# Altium project BeagleBone-AI.PrjPcb (part 3 of 5)

## Sheet 13 Processor Power Deco.SchDoc
size 420 x 297 mm
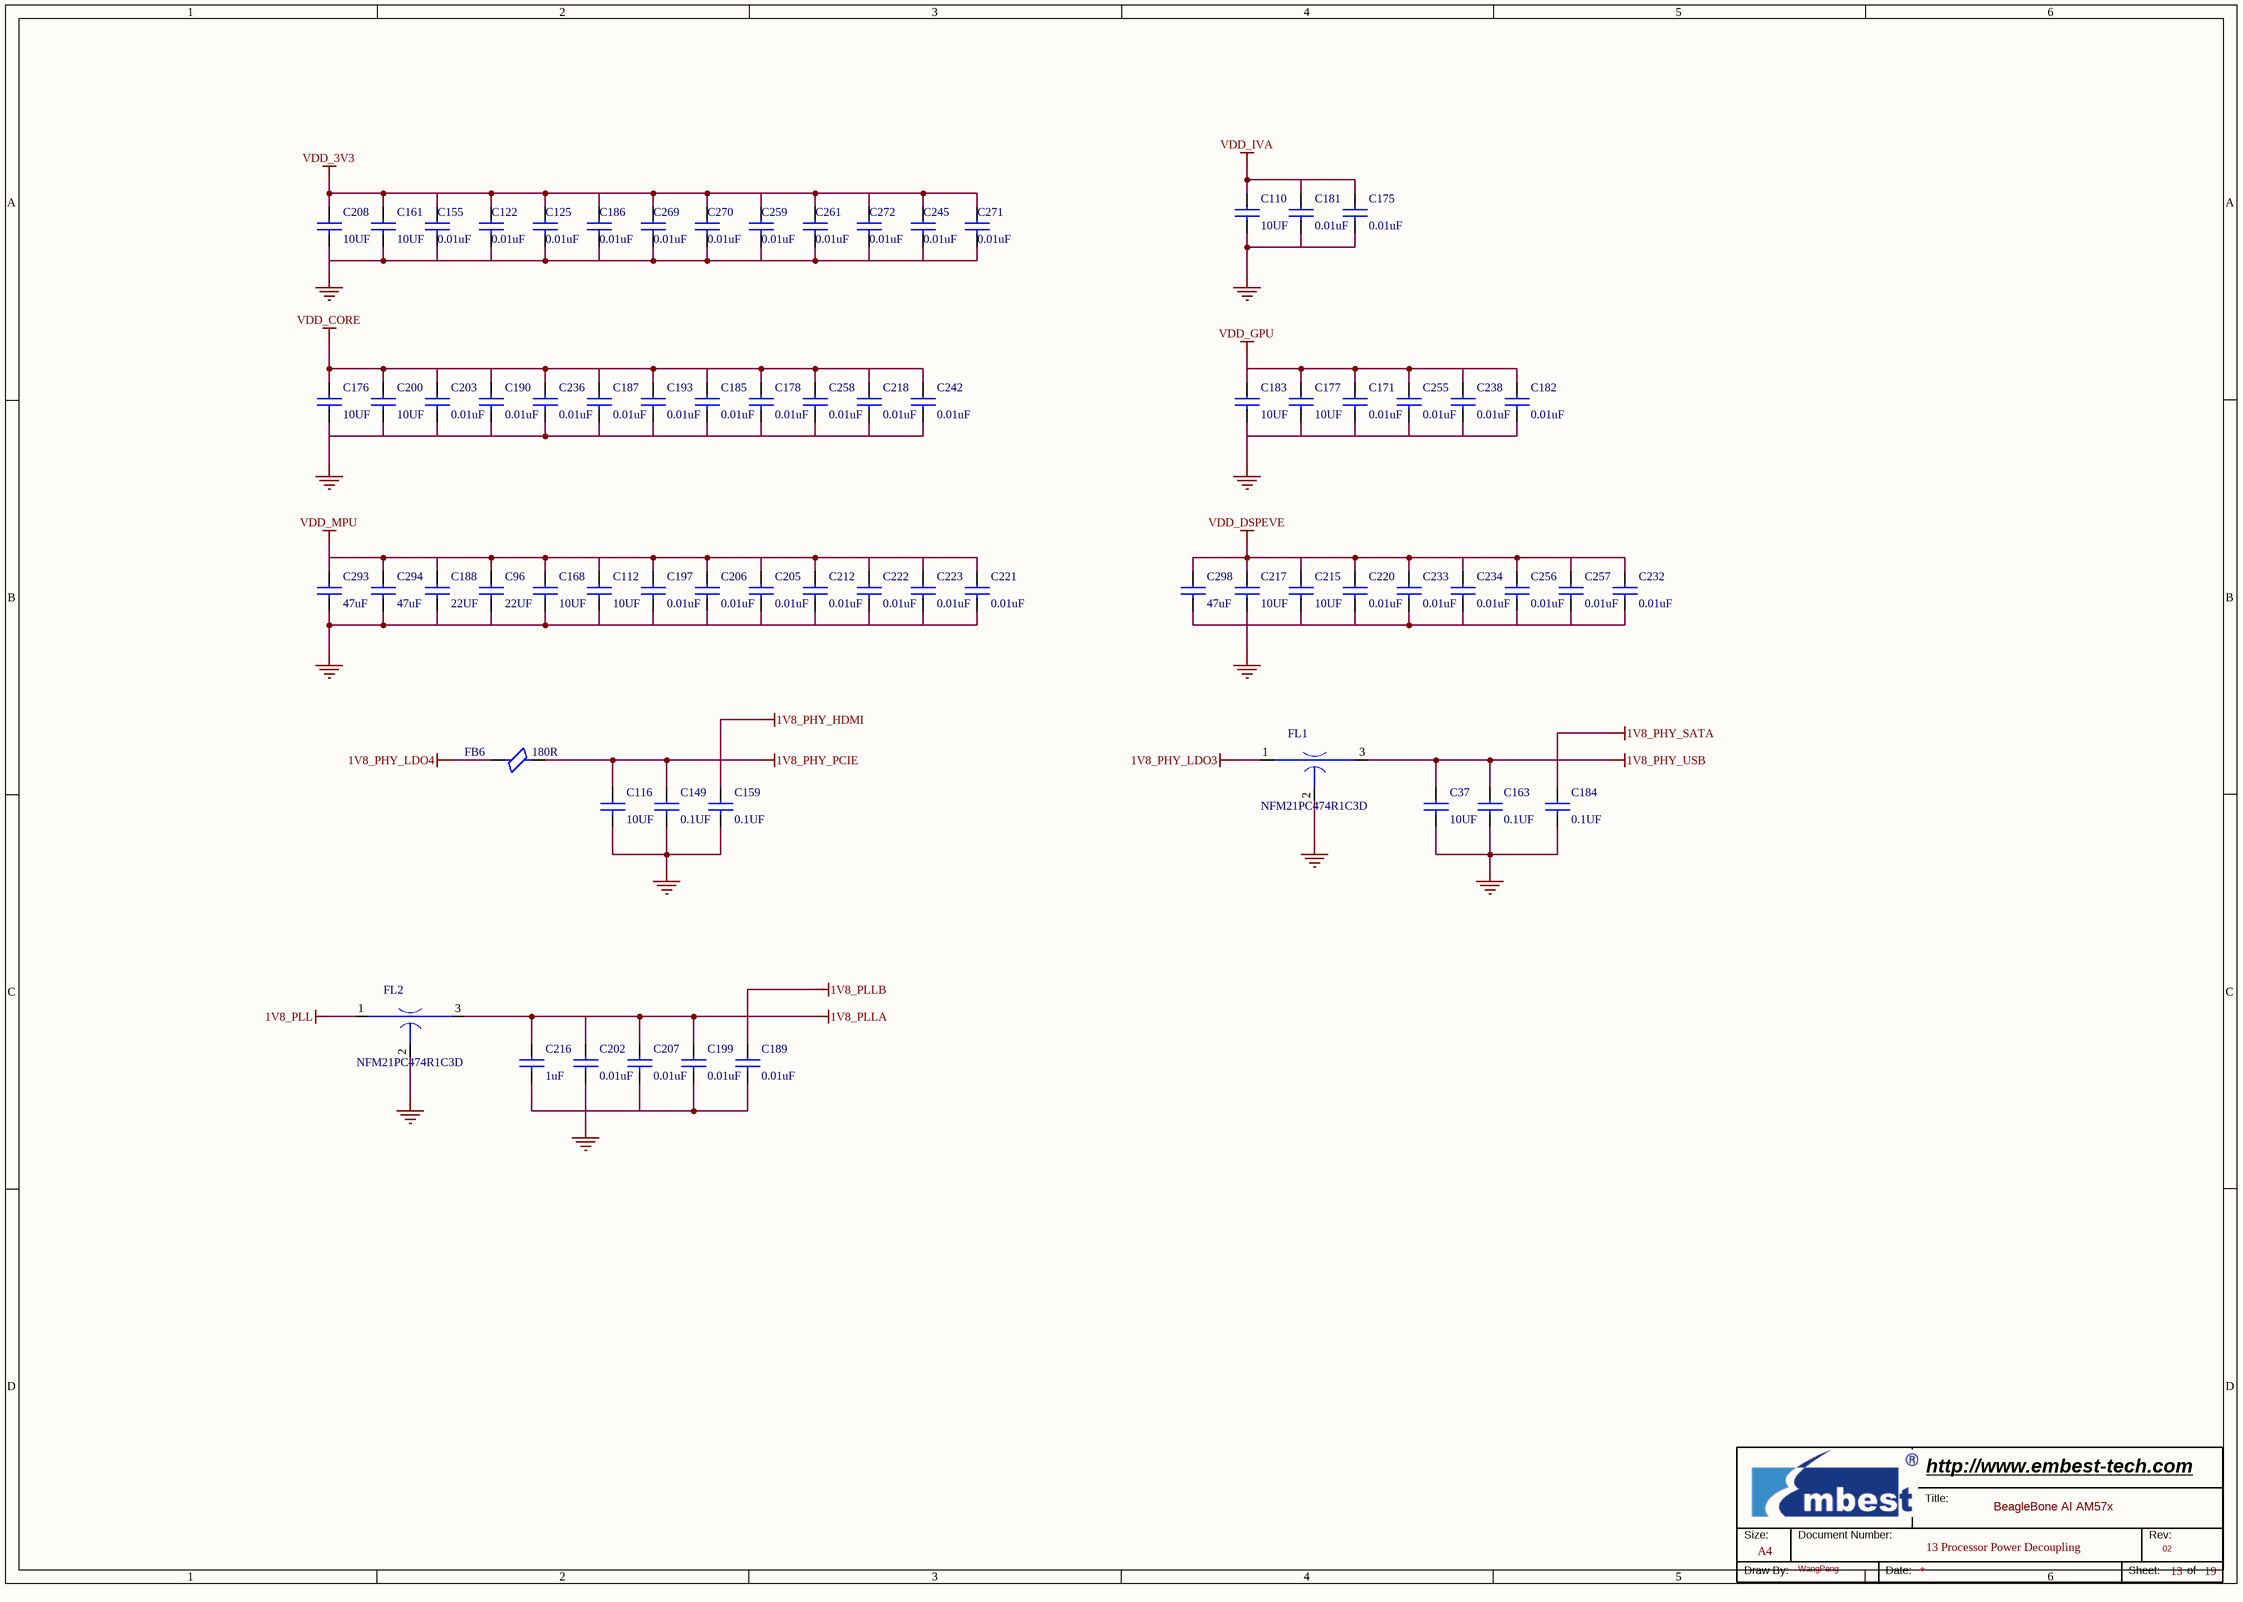
[diagram p14: 13 Processor Power Deco.SchDoc]

### Parts
(Parts that share a designator on the sheet are numbered #1, #2 ... from top to bottom, then left to right.)
*#11  Page Count: 19  Page Number: 13  Page Size: A4  Title: BeagleBone AI AM57x  RevCode: 02  Doc: 13 Processor Power Decoupling  Drawing: WangPeng  (hidden comment: Embest Title)  (graphical)
C37  10UF  [C0603]
C96  22UF  [C0603]
C110  10UF  [C0402]
C112  10UF  [C0402]
C116  10UF  [C0603]
C122  0.01uF  [C0402]
C125  0.01uF  [C0402]
C149  0.1UF  [C0402]
C155  0.01uF  [C0402]
C159  0.1UF  [C0402]
C161  10UF  [C0603]
C163  0.1UF  [C0402]
C168  10UF  [C0402]
C171  0.01uF  [C0402]
C175  0.01uF  [C0402]
C176  10UF  [C0402]
C177  10UF  [C0402]
C178  0.01uF  [C0402]
C181  0.01uF  [C0402]
C182  0.01uF  [C0402]
C183  10UF  [C0402]
C184  0.1UF  [C0402]
C185  0.01uF  [C0402]
C186  0.01uF  [C0402]
C187  0.01uF  [C0402]
C188  22UF  [C0603]
C189  0.01uF  [C0402]
C190  0.01uF  [C0402]
C193  0.01uF  [C0402]
C197  0.01uF  [C0402]
C199  0.01uF  [C0402]
C200  10UF  [C0402]
C202  0.01uF  [C0402]
C203  0.01uF  [C0402]
C205  0.01uF  [C0402]
C206  0.01uF  [C0402]
C207  0.01uF  [C0402]
C208  10UF  [C0603]
C212  0.01uF  [C0402]
C215  10UF  [C0402]
C216  1uF  [C0402]
C217  10UF  [C0402]
C218  0.01uF  [C0402]
C220  0.01uF  [C0402]
C221  0.01uF  [C0402]
C222  0.01uF  [C0402]
C223  0.01uF  [C0402]
C232  0.01uF  [C0402]
C233  0.01uF  [C0402]
C234  0.01uF  [C0402]
C236  0.01uF  [C0402]
C238  0.01uF  [C0402]
C242  0.01uF  [C0402]
C245  0.01uF  [C0402]
C255  0.01uF  [C0402]
C256  0.01uF  [C0402]
C257  0.01uF  [C0402]
C258  0.01uF  [C0402]
C259  0.01uF  [C0402]
C261  0.01uF  [C0402]
C269  0.01uF  [C0402]
C270  0.01uF  [C0402]
C271  0.01uF  [C0402]
C272  0.01uF  [C0402]
C293  47uF  [C0805]
C294  47uF  [C0805]
C298  47uF  [C0805]
FB6  180R  [L0603]
FL1  NFM21PC474R1C3D  [fl0805]
FL2  NFM21PC474R1C3D  [fl0805]

### Nets
1V8_PHY_HDMI: C159.1
1V8_PHY_LDO3: FL1.1
1V8_PHY_LDO4: FB6.1
1V8_PHY_PCIE: C116.1 C149.1 FB6.2
1V8_PHY_SATA: C184.1
1V8_PHY_USB: C37.1 C163.1 FL1.3
1V8_PLL: FL2.1
1V8_PLLA: C199.1 C202.1 C207.1 C216.1 FL2.3
1V8_PLLB: C189.1
GND: C37.2 C96.2 C110.2 C112.2 C116.2 C122.2 C125.2 C149.2 C155.2 C159.2 C161.2 C163.2 C168.2 C171.2 C175.2 C176.2 C177.2 C178.2 C181.2 C182.2 C183.2 C184.2 C185.2 C186.2 C187.2 C188.2 C190.2 C193.2 C197.2 C200.2 C202.2 C203.2 C205.2 C206.2 C208.2 C212.2 C217.2 C218.2 C221.2 C222.2 C223.2 C236.2 C238.2 C242.2 C245.2 C255.2 C258.2 C259.2 C261.2 C269.2 C270.2 C271.2 C272.2 C293.2 C294.2 FL1.2 FL2.2  [project net DDR1_RST]
VDD_3V3: C122.1 C125.1 C155.1 C161.1 C186.1 C208.1 C245.1 C259.1 C261.1 C269.1 C270.1 C271.1 C272.1
VDD_CORE: C176.1 C178.1 C185.1 C187.1 C190.1 C193.1 C200.1 C203.1 C218.1 C236.1 C242.1 C258.1
VDD_DSPEVE: C215.1 C217.1 C220.1 C232.1 C233.1 C234.1 C256.1 C257.1 C298.1
VDD_GPU: C171.1 C177.1 C182.1 C183.1 C238.1 C255.1
VDD_IVA: C110.1 C175.1 C181.1
VDD_MPU: C96.1 C112.1 C168.1 C188.1 C197.1 C205.1 C206.1 C212.1 C221.1 C222.1 C223.1 C293.1 C294.1
NetC189_2: C189.2 C199.2 C207.2 C216.2
NetC215_2: C215.2 C220.2 C232.2 C233.2 C234.2 C256.2 C257.2 C298.2

### Notes on the sheet
- (in symbol Embest Title) Title:; Size:; Document Number:; Rev:; Draw By:; Date:; Sheet:; of

### Library data of the parts
C37 C116 C161 = C: as C180 on sheet 12 Processor  Power; Datasheet: Y:\ÐÂK3ÏµÍ³ÎïÁÏdatasheet\[1003_1004]capacitor-resistor µçÈÝ¡¢µç×è\1004001100129T2 C1608X5R1A106M.pdf; Part Type: Ceramic Capacitor
C96 C188 = C: CAP,22UF,+/-20%,X5R,6.3V,SMD0603; Manufacturer: MURATA; Manufacturer Part Number: GRM188R60J226MEA0D; Embest PN: 1004001100130; Part Type: Ceramic Capacitor
C110 C112 C177 C200 = C: CAP,10UF,+/-20%,X5R,6.3V,SMD0402; Manufacturer: Yageo; Manufacturer Part Number: CC0402MRX5R5BB106; Embest PN: 1004001100345; Part Type: Ceramic Capacitor
C122 C125 C175 C181 C185-C187 C190 C193 C199 C203 C205-C207 C212 C220 C221 C223 C232-C234 C236 C242 C245 C256 C257 C259 C261 C272 = C: as C118 on sheet 12 Processor  Power; Part Type: Ceramic Capacitor
C149 C159 C163 = C: as C285 on sheet 09 MMC_UBOOT; Part Type: Ceramic Capacitor; Datasheet: Y:\ÐÂK3ÏµÍ³ÎïÁÏdatasheet\[1003_1004]capacitor-resistor µçÈÝ¡¢µç×è\1004001100047-GRM155R71C104KA88D.pdf
C155 C171 C178 C182 C189 C197 C202 C218 C222 C238 C255 C258 C269-C271 = C: as C119 on sheet 12 Processor  Power; Part Type: Ceramic Capacitor
C168 C176 C183 C215 C217 = C: CAP,10UF,+/-20%,X5R,6.3V,SMD0402; Manufacturer Part Number: CC0402MRX5R5BB106; Manufacturer: Yageo; Embest PN: 1004001100345; Part Type: Ceramic Capacitor
C184 = C: as C281 on sheet 09 MMC_UBOOT; Datasheet: Y:\ÐÂK3ÏµÍ³ÎïÁÏdatasheet\[1003_1004]capacitor-resistor µçÈÝ¡¢µç×è\1004001100047-GRM155R71C104KA88D.pdf; Part Type: Ceramic Capacitor
C208 = C: as C120 on sheet 12 Processor  Power; Part Type: Ceramic Capacitor; Datasheet: Y:\ÐÂK3ÏµÍ³ÎïÁÏdatasheet\[1003_1004]capacitor-resistor µçÈÝ¡¢µç×è\1004001100129T2 C1608X5R1A106M.pdf
C216 = C: CAP,1UF,+/-10%,X5R,16V,SMD0402; Manufacturer: Murata; Manufacturer Part Number: GRM155R61C105KA12D; Embest PN: 1004001100058; Part Type: Ceramic Capacitor
C293 C294 C298 = C: CAP,47UF,+/-20%,X5R,6.3V,SMD0805; Manufacturer Part Number: GRM21BR60J476ME15L; Manufacturer: MURATA; Embest PN: 1004001100164; Part Type: Ceramic Capacitor
FB6 = FB: Ferrite Bead,180ohm@100MHz,+/-25%,1500mA,0.09ohm,SMD0603; Manufacturer Part Number: BLM18PG181SN1D; Manufacturer: Murata; Embest PN: 1005005100012; Part Type: Ferrite Bead
FL1 FL2 = FL: CAP Feedthru 0.47UF 20% 16V 0805; Manufacturer: Murata; Embest PN: 1013002100020; Status: AM5728; Manufacturer Part Number: NFM21PC474R1C3D; Part Type: filter
*#11 = Embest Title: Page Create Date: May 29, 2006; WebSite: http://www.embest-tech.com; Company: Embest; Page Modify Date: *

## Sheet 14 Exp Conn.SchDoc
size 420 x 297 mm
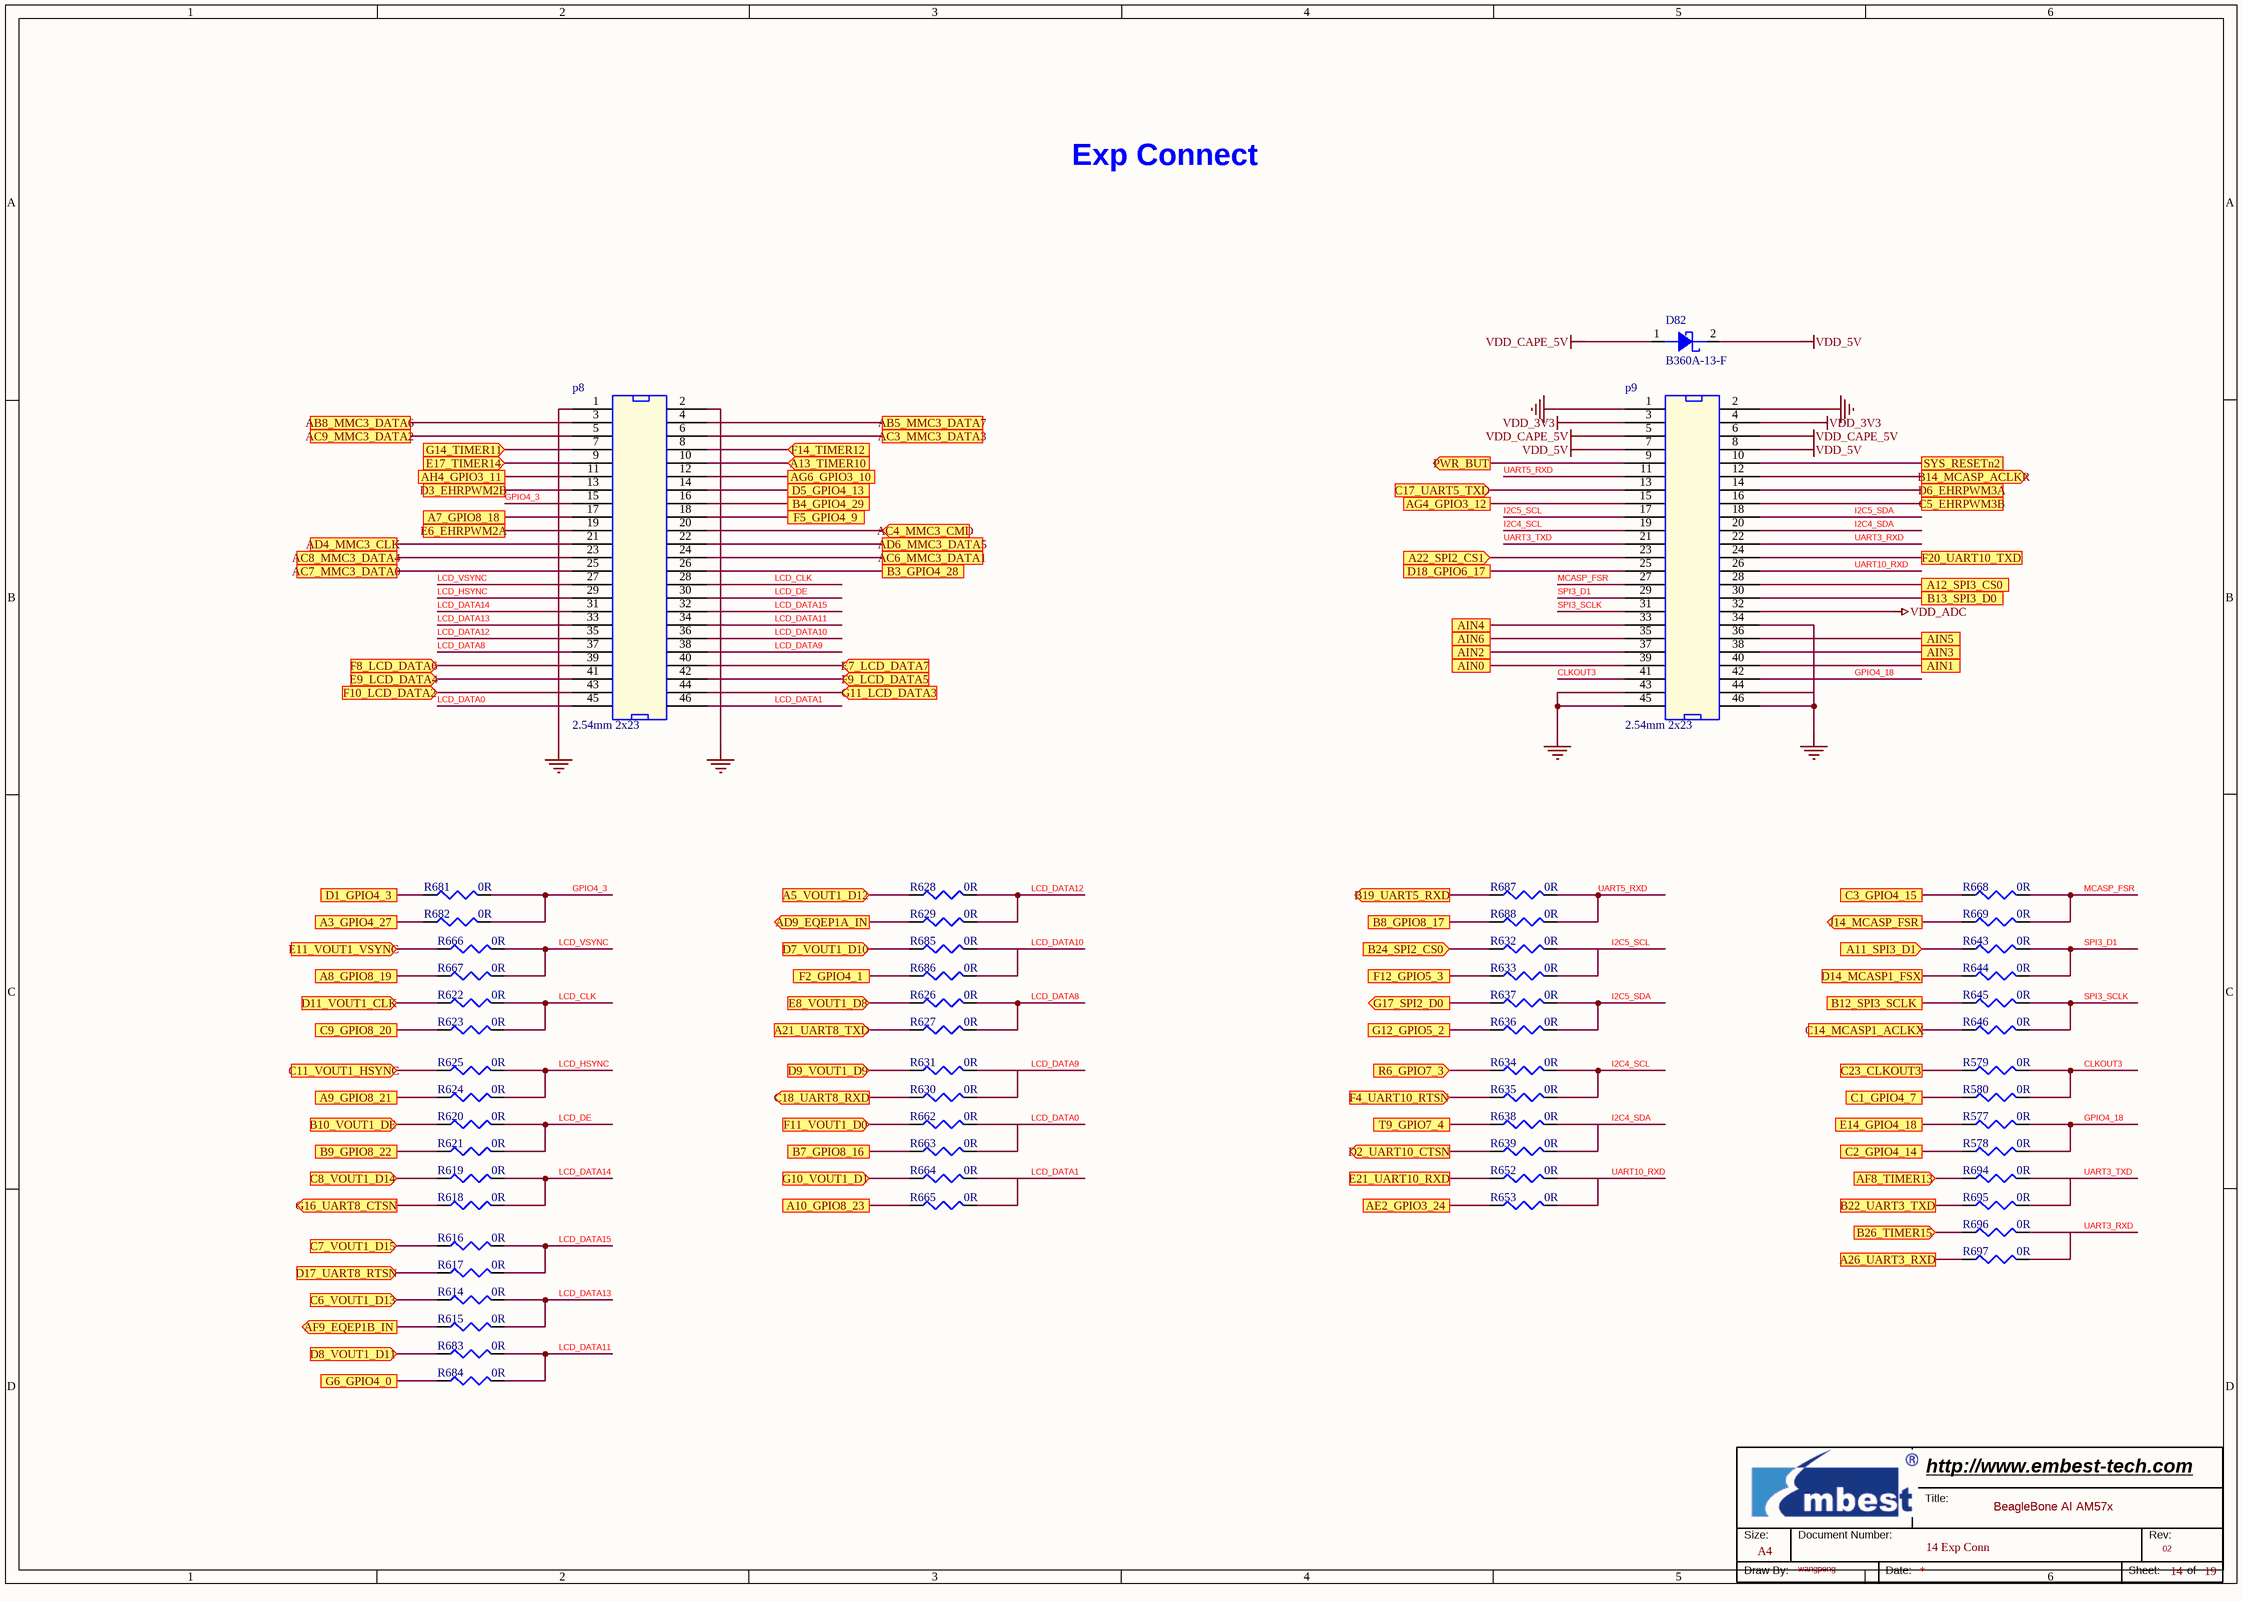
[diagram p15: 14 Exp Conn.SchDoc]

### Parts
(Parts that share a designator on the sheet are numbered #1, #2 ... from top to bottom, then left to right.)
*#12  Page Count: 19  Page Number: 14  Page Size: A4  Title: BeagleBone AI AM57x  RevCode: 02  Doc: 14 Exp Conn  Drawing: wangpeng  (hidden comment: Embest Title)  (graphical)
D82  B360A-13-F  [D_SMA]
p8  2.54mm 2x23  [h2x23mz]
p9  2.54mm 2x23  [h2x23mz]
R577  0R  [R0402]
R578  0R  [R0402]
R579  0R  [R0402]
R580  0R  [R0402]
R614  0R  [R0402]
R615  0R  [R0402]
R616  0R  [R0402]
R617  0R  [R0402]
R618  0R  [R0402]
R619  0R  [R0402]
R620  0R  [R0402]
R621  0R  [R0402]
R622  0R  [R0402]
R623  0R  [R0402]
R624  0R  [R0402]
R625  0R  [R0402]
R626  0R  [R0402]
R627  0R  [R0402]
R628  0R  [R0402]
R629  0R  [R0402]
R630  0R  [R0402]
R631  0R  [R0402]
R632  0R  [R0402]
R633  0R  [R0402]
R634  0R  [R0402]
R635  0R  [R0402]
R636  0R  [R0402]
R637  0R  [R0402]
R638  0R  [R0402]
R639  0R  [R0402]
R643  0R  [R0402]
R644  0R  [R0402]
R645  0R  [R0402]
R646  0R  [R0402]
R652  0R  [R0402]
R653  0R  [R0402]
R662  0R  [R0402]
R663  0R  [R0402]
R664  0R  [R0402]
R665  0R  [R0402]
R666  0R  [R0402]
R667  0R  [R0402]
R668  0R  [R0402]
R669  0R  [R0402]
R681  0R  [R0402]
R682  0R  [R0402]
R683  0R  [R0402]
R684  0R  [R0402]
R685  0R  [R0402]
R686  0R  [R0402]
R687  0R  [R0402]
R688  0R  [R0402]
R694  0R  [R0402]
R695  0R  [R0402]
R696  0R  [R0402]
R697  0R  [R0402]

### Ports
A3_GPIO4_27, A5_VOUT1_D12 (in), A7_GPIO8_18, A8_GPIO8_19, A9_GPIO8_21, A10_GPIO8_23, A11_SPI3_D1 (in), A12_SPI3_CS0, A13_TIMER10 (in), A21_UART8_TXD (in), A22_SPI2_CS1 (in), A26_UART3_RXD, AB5_MMC3_DATA7, AB8_MMC3_DATA6, AC3_MMC3_DATA3, AC4_MMC3_CMD (in), AC6_MMC3_DATA1, AC7_MMC3_DATA0, AC8_MMC3_DATA4, AC9_MMC3_DATA2, AD4_MMC3_CLK, AD6_MMC3_DATA5, AD9_EQEP1A_IN (out), AE2_GPIO3_24, AF8_TIMER13 (in), AF9_EQEP1B_IN (out), AG4_GPIO3_12, AG6_GPIO3_10, AH4_GPIO3_11, AIN0, AIN1, AIN2, AIN3, AIN4, AIN5, AIN6, B3_GPIO4_28, B4_GPIO4_29, B7_GPIO8_16, B8_GPIO8_17, B9_GPIO8_22, B10_VOUT1_DE (in), B12_SPI3_SCLK, B13_SPI3_D0, B14_MCASP_ACLKR (out), B19_UART5_RXD (out), B22_UART3_TXD, B24_SPI2_CS0 (in), B26_TIMER15 (in), C1_GPIO4_7, C2_GPIO4_14, C3_GPIO4_15, C5_EHRPWM3B, C6_VOUT1_D13 (in), C7_VOUT1_D15 (in), C8_VOUT1_D14 (in), C9_GPIO8_20, C11_VOUT1_HSYNC (in), C14_MCASP1_ACLKX, C17_UART5_TXD (in), C18_UART8_RXD (out), C23_CLKOUT3, D1_GPIO4_3, D2_UART10_CTSN (out), D3_EHRPWM2B, D5_GPIO4_13, D6_EHRPWM3A, D7_VOUT1_D10 (in), D8_VOUT1_D11 (in), D9_VOUT1_D9 (in), D11_VOUT1_CLK (in), D14_MCASP1_FSX, D17_UART8_RTSN (in), D18_GPIO6_17, E6_EHRPWM2A, E7_LCD_DATA7 (in), E8_VOUT1_D8 (in), E9_LCD_DATA4 (in), E11_VOUT1_VSYNC (in), E14_GPIO4_18, E17_TIMER14 (in), E21_UART10_RXD, F2_GPIO4_1, F4_UART10_RTSN (in), F5_GPIO4_9, F8_LCD_DATA6 (in), F9_LCD_DATA5 (in), F10_LCD_DATA2 (in), F11_VOUT1_D0 (in), F12_GPIO5_3, F14_TIMER12 (in), F20_UART10_TXD, G6_GPIO4_0, G10_VOUT1_D1 (in), G11_LCD_DATA3 (in), G12_GPIO5_2, G14_TIMER11 (in), G16_UART8_CTSN (out), G17_SPI2_D0 (out), J14_MCASP_FSR (out), PWR_BUT (out), R6_GPIO7_3 (in), SYS_RESETn2, T9_GPIO7_4

### Nets
GND: p8.1 p8.2 p9.1 p9.2 p9.34 p9.43 p9.44 p9.45 p9.46  [project net DDR1_RST]
VDD_3V3: p9.3 p9.4
VDD_5V: D82.2(C) p9.7 p9.8
VDD_ADC: p9.32
VDD_CAPE_5V: D82.1(A) p9.5 p9.6
AIN0: p9.39 ; port AIN0
AIN1: p9.40 ; port AIN1
AIN2: p9.37 ; port AIN2
AIN3: p9.38 ; port AIN3
AIN4: p9.33 ; port AIN4
AIN5: p9.36 ; port AIN5
AIN6: p9.35 ; port AIN6
CLKOUT3: p9.41 R579.2 R580.1
GPIO4_3: p8.15 R681.2 R682.2
GPIO4_18: p9.42 R577.2 R578.2
I2C4_SCL: p9.19 R634.2 R635.2
I2C4_SDA: p9.20 R638.2 R639.2
I2C5_SCL: p9.17 R632.2 R633.2
I2C5_SDA: p9.18 R636.1 R637.2
LCD_CLK: p8.28 R622.2 R623.2
LCD_DATA0: p8.45 R662.2 R663.2
LCD_DATA1: p8.46 R664.2 R665.2
LCD_DATA8: p8.37 R626.2 R627.2
LCD_DATA9: p8.38 R630.1 R631.2
LCD_DATA10: p8.36 R685.2 R686.2
LCD_DATA11: p8.34 R683.2 R684.2
LCD_DATA12: p8.35 R628.2 R629.2
LCD_DATA13: p8.33 R614.2 R615.2
LCD_DATA14: p8.31 R618.1 R619.2
LCD_DATA15: p8.32 R616.2 R617.2
LCD_DE: p8.30 R620.2 R621.2
LCD_HSYNC: p8.29 R624.1 R625.2
LCD_VSYNC: p8.27 R666.2 R667.2
MCASP_FSR: p9.27 R668.2 R669.2
PWR_BUT: p9.9 ; port PWR_BUT
SPI3_D1: p9.29 R643.2 R644.2
SPI3_SCLK: p9.31 R645.2 R646.2
UART3_RXD: p9.22 R696.2 R697.2
UART3_TXD: p9.21 R694.2 R695.2
UART5_RXD: p9.11 R687.2 R688.2
UART10_RXD: p9.26 R652.2 R653.2
Netp8_3: p8.3 ; port AB8_MMC3_DATA6
Netp8_4: p8.4 ; port AB5_MMC3_DATA7
Netp8_5: p8.5 ; port AC9_MMC3_DATA2
Netp8_6: p8.6 ; port AC3_MMC3_DATA3
Netp8_7: p8.7 ; port G14_TIMER11
Netp8_8: p8.8 ; port F14_TIMER12
Netp8_9: p8.9 ; port E17_TIMER14
Netp8_10: p8.10 ; port A13_TIMER10
Netp8_11: p8.11 ; port AH4_GPIO3_11
Netp8_12: p8.12 ; port AG6_GPIO3_10
Netp8_13: p8.13 ; port D3_EHRPWM2B
Netp8_14: p8.14 ; port D5_GPIO4_13
Netp8_16: p8.16 ; port B4_GPIO4_29
Netp8_17: p8.17 ; port A7_GPIO8_18
Netp8_18: p8.18 ; port F5_GPIO4_9
Netp8_19: p8.19 ; port E6_EHRPWM2A
Netp8_20: p8.20 ; port AC4_MMC3_CMD
Netp8_21: p8.21 ; port AD4_MMC3_CLK
Netp8_22: p8.22 ; port AD6_MMC3_DATA5
Netp8_23: p8.23 ; port AC8_MMC3_DATA4
Netp8_24: p8.24 ; port AC6_MMC3_DATA1
Netp8_25: p8.25 ; port AC7_MMC3_DATA0
Netp8_26: p8.26 ; port B3_GPIO4_28
Netp8_39: p8.39 ; port F8_LCD_DATA6
Netp8_40: p8.40 ; port E7_LCD_DATA7
Netp8_41: p8.41 ; port E9_LCD_DATA4
Netp8_42: p8.42 ; port F9_LCD_DATA5
Netp8_43: p8.43 ; port F10_LCD_DATA2
Netp8_44: p8.44 ; port G11_LCD_DATA3
Netp9_10: p9.10 ; port SYS_RESETn2
Netp9_12: p9.12 ; port B14_MCASP_ACLKR
Netp9_13: p9.13 ; port C17_UART5_TXD
Netp9_14: p9.14 ; port D6_EHRPWM3A
Netp9_15: p9.15 ; port AG4_GPIO3_12
Netp9_16: p9.16 ; port C5_EHRPWM3B
Netp9_23: p9.23 ; port A22_SPI2_CS1
Netp9_24: p9.24 ; port F20_UART10_TXD
Netp9_25: p9.25 ; port D18_GPIO6_17
Netp9_28: p9.28 ; port A12_SPI3_CS0
Netp9_30: p9.30 ; port B13_SPI3_D0
NetR577_1: R577.1 ; port E14_GPIO4_18
NetR578_1: R578.1 ; port C2_GPIO4_14
NetR579_1: R579.1 ; port C23_CLKOUT3
NetR580_2: R580.2 ; port C1_GPIO4_7
NetR614_1: R614.1 ; port C6_VOUT1_D13
NetR615_1: R615.1 ; port AF9_EQEP1B_IN
NetR616_1: R616.1 ; port C7_VOUT1_D15
NetR617_1: R617.1 ; port D17_UART8_RTSN
NetR618_2: R618.2 ; port G16_UART8_CTSN
NetR619_1: R619.1 ; port C8_VOUT1_D14
NetR620_1: R620.1 ; port B10_VOUT1_DE
NetR621_1: R621.1 ; port B9_GPIO8_22
NetR622_1: R622.1 ; port D11_VOUT1_CLK
NetR623_1: R623.1 ; port C9_GPIO8_20
NetR624_2: R624.2 ; port A9_GPIO8_21
NetR625_1: R625.1 ; port C11_VOUT1_HSYNC
NetR626_1: R626.1 ; port E8_VOUT1_D8
NetR627_1: R627.1 ; port A21_UART8_TXD
NetR628_1: R628.1 ; port A5_VOUT1_D12
NetR629_1: R629.1 ; port AD9_EQEP1A_IN
NetR630_2: R630.2 ; port C18_UART8_RXD
NetR631_1: R631.1 ; port D9_VOUT1_D9
NetR632_1: R632.1 ; port B24_SPI2_CS0
NetR633_1: R633.1 ; port F12_GPIO5_3
NetR634_1: R634.1 ; port R6_GPIO7_3
NetR635_1: R635.1 ; port F4_UART10_RTSN
NetR636_2: R636.2 ; port G12_GPIO5_2
NetR637_1: R637.1 ; port G17_SPI2_D0
NetR638_1: R638.1 ; port T9_GPIO7_4
NetR639_1: R639.1 ; port D2_UART10_CTSN
NetR643_1: R643.1 ; port A11_SPI3_D1
NetR644_1: R644.1 ; port D14_MCASP1_FSX
NetR645_1: R645.1 ; port B12_SPI3_SCLK
NetR646_1: R646.1 ; port C14_MCASP1_ACLKX
NetR652_1: R652.1 ; port E21_UART10_RXD
NetR653_1: R653.1 ; port AE2_GPIO3_24
NetR662_1: R662.1 ; port F11_VOUT1_D0
NetR663_1: R663.1 ; port B7_GPIO8_16
NetR664_1: R664.1 ; port G10_VOUT1_D1
NetR665_1: R665.1 ; port A10_GPIO8_23
NetR666_1: R666.1 ; port E11_VOUT1_VSYNC
NetR667_1: R667.1 ; port A8_GPIO8_19
NetR668_1: R668.1 ; port C3_GPIO4_15
NetR669_1: R669.1 ; port J14_MCASP_FSR
NetR681_1: R681.1 ; port D1_GPIO4_3
NetR682_1: R682.1 ; port A3_GPIO4_27
NetR683_1: R683.1 ; port D8_VOUT1_D11
NetR684_1: R684.1 ; port G6_GPIO4_0
NetR685_1: R685.1 ; port D7_VOUT1_D10
NetR686_1: R686.1 ; port F2_GPIO4_1
NetR687_1: R687.1 ; port B19_UART5_RXD
NetR688_1: R688.1 ; port B8_GPIO8_17
NetR694_1: R694.1 ; port AF8_TIMER13
NetR695_1: R695.1 ; port B22_UART3_TXD
NetR696_1: R696.1 ; port B26_TIMER15
NetR697_1: R697.1 ; port A26_UART3_RXD

### Notes on the sheet
- Exp Connect
- (in symbol Embest Title) Title:; Size:; Document Number:; Rev:; Draw By:; Date:; Sheet:; of

### Library data of the parts
D82 = Diode Schottky: Diode,Schottky Diode,B360A-13-F,60V,3A,SMA,SMD; Manufacturer: DIODES; Embest PN: 1006002100006; Datasheet: Y:\ÐÂK3ÏµÍ³ÎïÁÏdatasheet\[1006002~013]diodes-transistors ¶þÈý¼«¹Ü\1006002100006 B360A-13-F diodes.pdf; Manufacturer Part Number: B360A-13-F; Part Type: Diode
p8 = HEAD2X23: Connector,Pin Socket,Straight,Female,2x23Pin,2.54MM pitch,8.5,3.0,Gold Flash 1u, black,DIP; Manufacturer: MTCONN; Manufacturer Part Number: JT254F-D180-850-223-001-G; Embest PN: 1009002200073; Part Type: Pin Socket; Status: BB-Black(AM437x)
p9 = HEAD2X23: Connector,Pin Socket,Straight,Female,2x23Pin,2.54MM pitch,8.5,3.0,Gold Flash 1u, black,DIP; Manufacturer Part Number: JT254F-D180-850-223-001-G; Manufacturer: MTCONN; Embest PN: 1009002200073; Status: BB-Black(AM437x); Part Type: Pin Socket
R577 R578 R618 R619 R626 R627 R632-R635 R643-R646 R663 R664 R667 R668 R681 R683 R685 R687 R688 = R: as R183 on sheet 09 MMC_UBOOT; Part Type: Thick film Resistor
R579 R580 R614-R617 R620-R625 R628-R631 R636-R639 R652 R653 R662 R665 R666 R669 R682 R684 R686 R694-R697 = R: as R703 on sheet 09 MMC_UBOOT; Part Type: Thick film Resistor
*#12 = Embest Title: Page Create Date: May 29, 2006; WebSite: http://www.embest-tech.com; Company: Embest; Page Modify Date: *

## Sheet 15 WIFI.SchDoc
size 420 x 297 mm
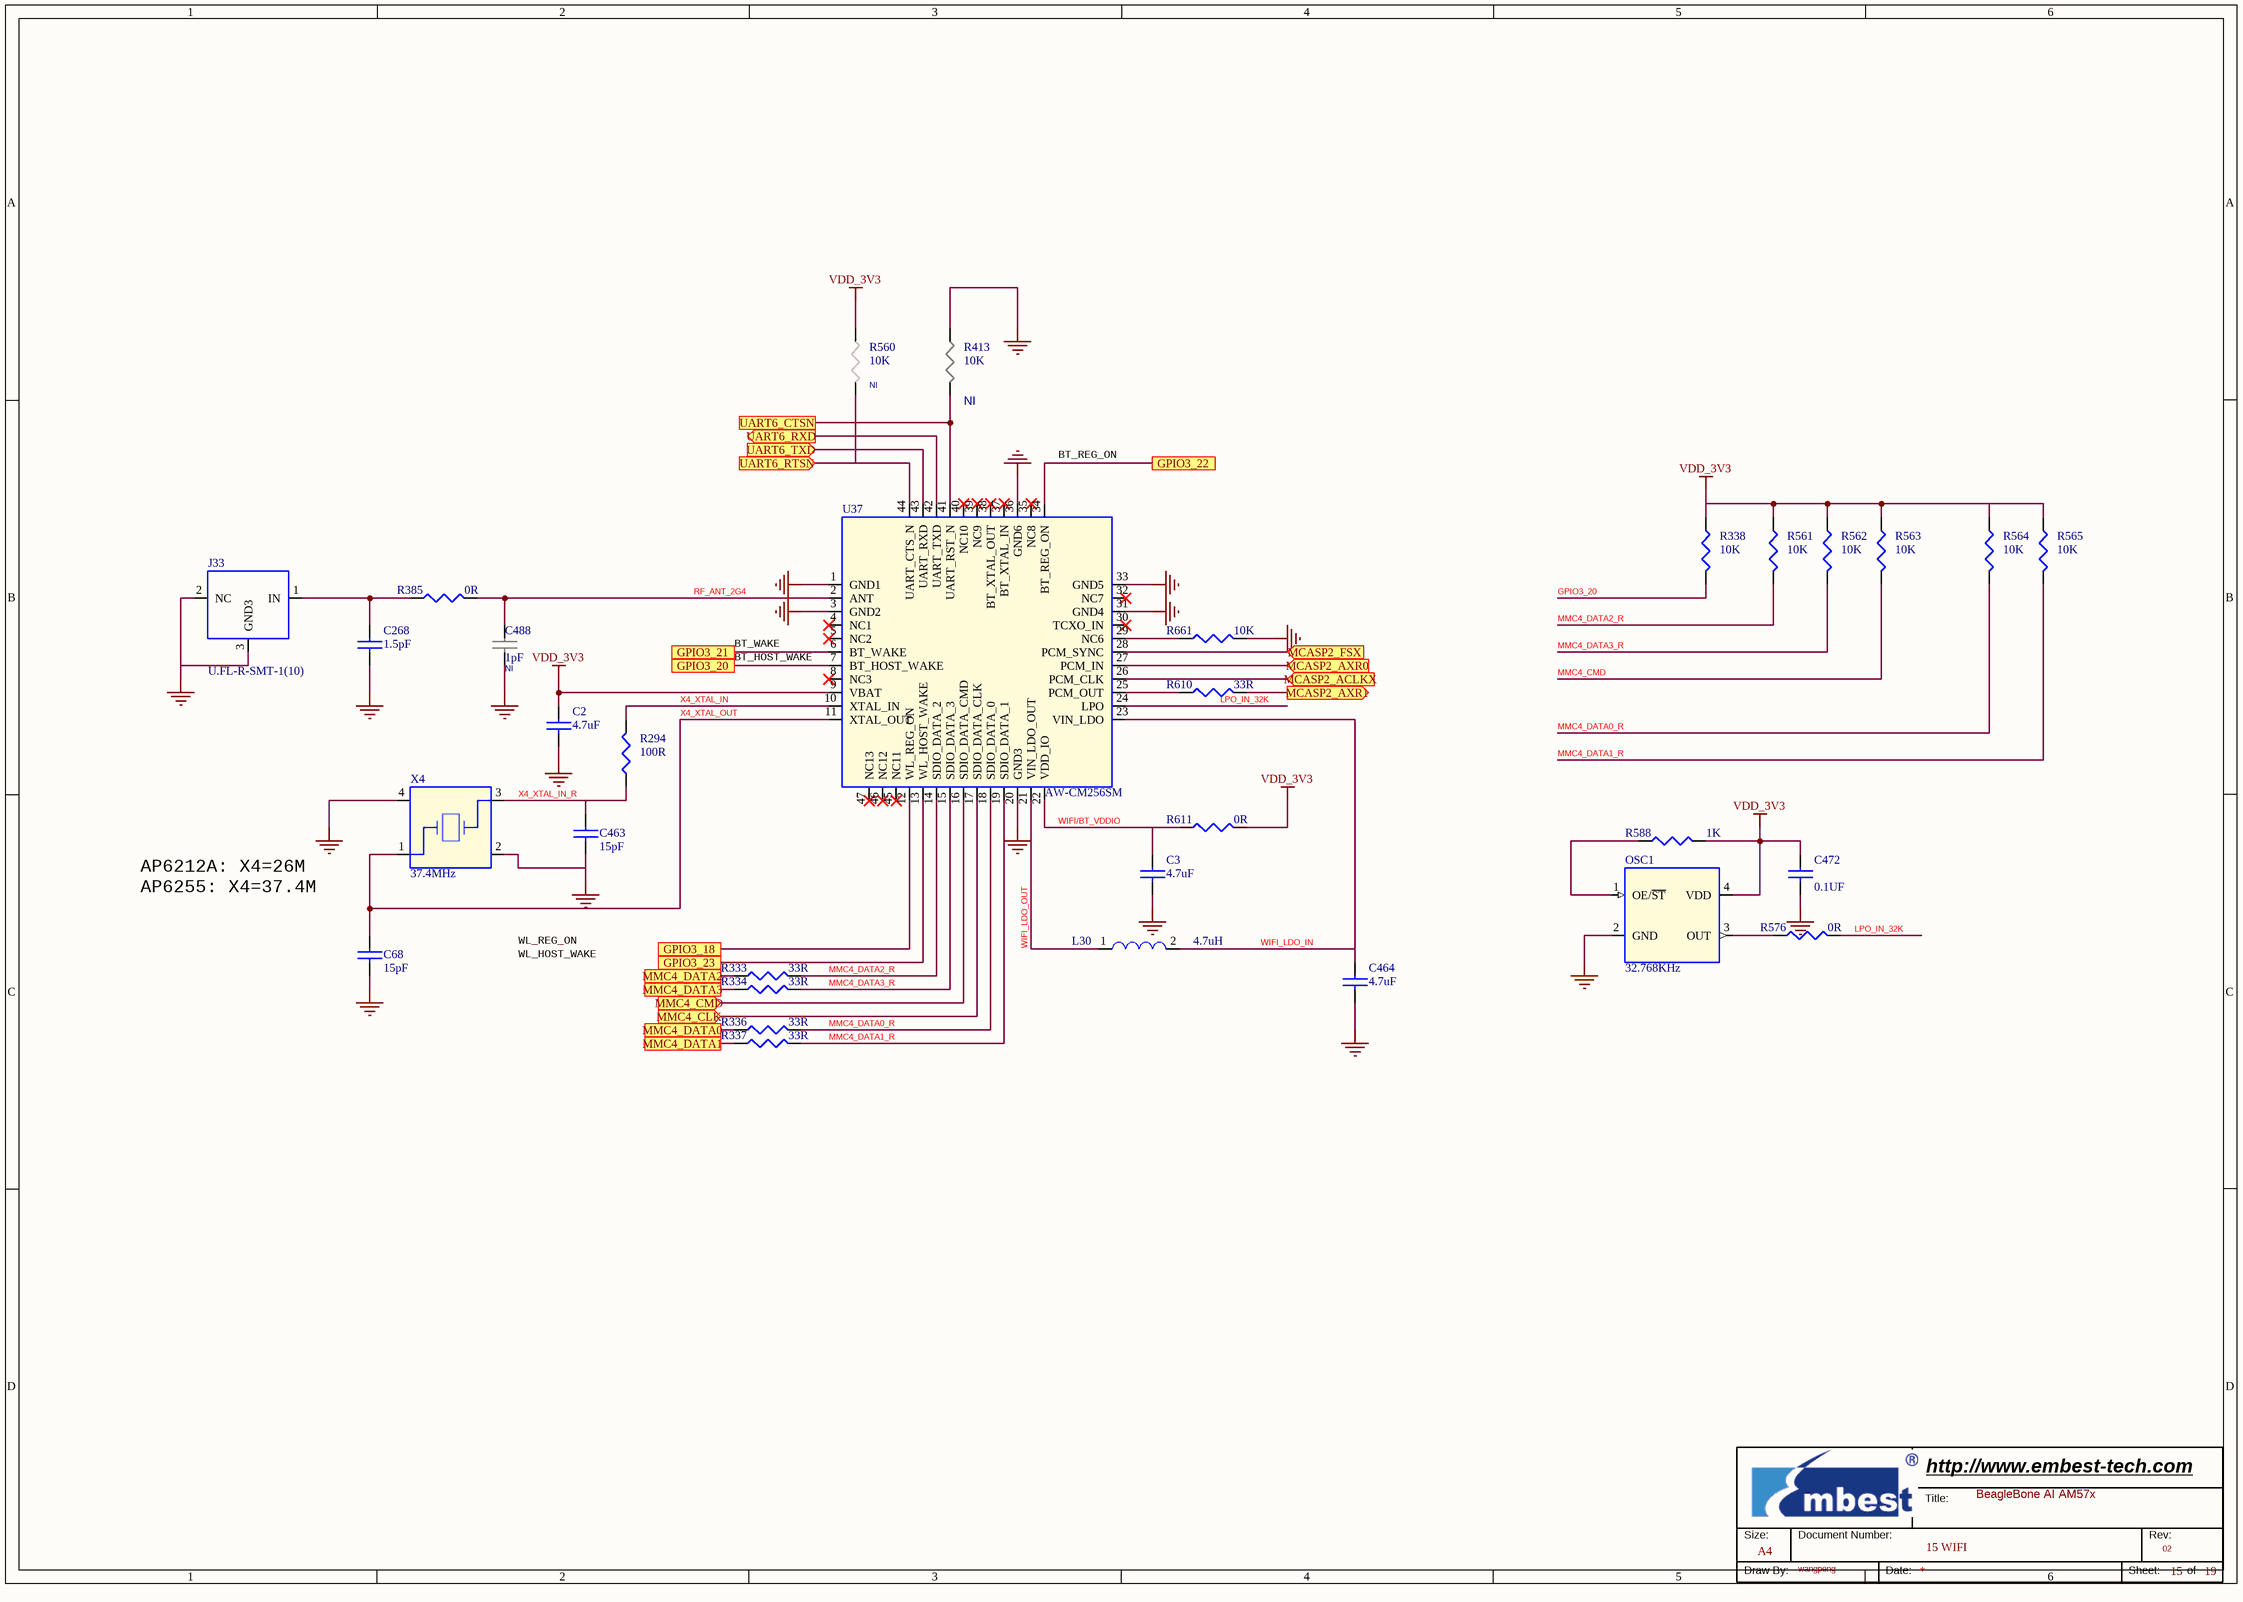
[diagram p16: 15 WIFI.SchDoc]

### Parts
(Parts that share a designator on the sheet are numbered #1, #2 ... from top to bottom, then left to right.)
*#13  Page Count: 19  Page Number: 15  Page Size: A4  Title: BeagleBone AI AM57x  RevCode: 02  Doc: 15 WIFI  Drawing: wangpeng  (hidden comment: Embest Title)  (graphical)
C2  4.7uF  [C0603]
C3  4.7uF  [C0603]
C68  15pF  [C0402]
C268  1.5pF  [C0402]
C463  15pF  [C0402]
C464  4.7uF  [C0603]
C472  0.1UF  [C0402]
C488  1pF  ASSY: NI  [C0402]
J33  U.FL-R-SMT-1(10)  [ANT3S_26X26]
L30  4.7uH  [L25X20]
OSC1  32.768KHz  [X4S25X20]
R294  100R  [R0402]
R333  33R  [R0402]
R334  33R  [R0402]
R336  33R  [R0402]
R337  33R  [R0402]
R338  10K  [R0402]
R385  0R  [R0402]
R413  10K  ASSY: NI  [R0402]
R560  10K  ASSY: NI  [R0402]
R561  10K  [R0402]
R562  10K  [R0402]
R563  10K  [R0402]
R564  10K  [R0402]
R565  10K  [R0402]
R576  0R  [R0402]
R588  1K  [R0402]
R610  33R  [R0402]
R611  0R  [R0402]
R661  10K  [R0402]
U37  AW-CM256SM  [WLBT90P1200X1200X160-47N]
X4  37.4MHz  [X4S16X12]

### Ports
GPIO3_18, GPIO3_20, GPIO3_21, GPIO3_22, GPIO3_23, MCASP2_ACLKX (in), MCASP2_AXR0 (in), MCASP2_AXR1 (out), MCASP2_FSX (in), MMC4_CLK (in), MMC4_CMD (in), MMC4_DATA0, MMC4_DATA1, MMC4_DATA2, MMC4_DATA3, UART6_CTSN, UART6_RTSN (in), UART6_RXD (out), UART6_TXD (in)

### Nets
GND: C2.2 C3.2 C68.2 C268.2 C463.2 C464.2 C472.2 C488.2 J33.2(NC) J33.3(GND3) OSC1.2(GND) R413.1 R661.2 U37.1(GND1) U37.3(GND2) U37.20(GND3) U37.31(GND4) U37.33(GND5) U37.36(GND6) X4.2 X4.4  [project net DDR1_RST]
VDD_3V3: C2.1 C472.1 OSC1.4(VDD) R338.1 R560.1 R561.1 R562.1 R563.1 R564.1 R565.1 R588.2 R611.2 U37.9(VBAT)
GPIO3_20: R338.2
LPO_IN_32K: R576.2 U37.24(LPO)
MMC4_CMD: R563.2
MMC4_DATA0_R: R336.2 R564.2 U37.18(SDIO_DATA_0)
MMC4_DATA1_R: R337.2 R565.2 U37.19(SDIO_DATA_1)
MMC4_DATA2_R: R333.2 R561.2 U37.14(SDIO_DATA_2)
MMC4_DATA3_R: R334.2 R562.2 U37.15(SDIO_DATA_3)
RF_ANT_2G4: C488.1 R385.2 U37.2(ANT)
WIFI/BT_VDDIO: C3.1 R611.1 U37.22(VDD_IO)
WIFI_LDO_IN: C464.1 L30.2 U37.23(VIN_LDO)
WIFI_LDO_OUT: L30.1 U37.21(VIN_LDO_OUT)
X4_XTAL_IN: R294.2 U37.10(XTAL_IN)
X4_XTAL_IN_R: C463.1 R294.1 X4.3
X4_XTAL_OUT: C68.1 U37.11(XTAL_OUT) X4.1
NetC268_1: C268.1 J33.1(IN) R385.1
NetOSC1_1: OSC1.1(OE/~{ST}) R588.1
NetOSC1_3: OSC1.3(OUT) R576.1
NetR333_1: R333.1 ; port MMC4_DATA2
NetR334_1: R334.1 ; port MMC4_DATA3
NetR336_1: R336.1 ; port MMC4_DATA0
NetR337_1: R337.1 ; port MMC4_DATA1
NetR413_2: R413.2 U37.41(UART_RST_N) ; port UART6_CTSN
NetR560_2: R560.2 U37.44(UART_CTS_N) ; port UART6_RTSN
NetR581_1: U37.16(SDIO_DATA_CMD) ; port MMC4_CMD
NetR582_1: U37.17(SDIO_DATA_CLK) ; port MMC4_CLK
NetR607_2: U37.28(PCM_SYNC) ; port MCASP2_FSX
NetR608_2: U37.26(PCM_CLK) ; port MCASP2_ACLKX
NetR609_2: U37.27(PCM_IN) ; port MCASP2_AXR0
NetR610_1: R610.1 U37.25(PCM_OUT)
NetR610_2: R610.2 ; port MCASP2_AXR1
NetR661_1: R661.1 U37.29(NC6)
NetU4_AE1: U37.13(WL_HOST_WAKE) ; port GPIO3_23
NetU4_AE3: U37.6(BT_WAKE) ; port GPIO3_21
NetU4_AE5: U37.34(BT_REG_ON) ; port GPIO3_22
NetU4_AF1: U37.7(BT_HOST_WAKE) ; port GPIO3_20
NetU4_AF3: U37.12(WL_REG_ON) ; port GPIO3_18
NetU4_P6: U37.42(UART_TXD) ; port UART6_RXD
NetU4_R9: U37.43(UART_RXD) ; port UART6_TXD

Not connected (* = marked no-connect by the designer): U37 4(NC1)* 5(NC2)* 8(NC3)* 30(TCXO_IN)* 32(NC7)* 35(NC8)* 37(BT_XTAL_IN)* 38(BT_XTAL_OUT)* 39(NC9)* 40(NC10)* 45(NC11)* 46(NC12)* 47(NC13)*

### Notes on the sheet
- BT_REG_ON
- BT_WAKE
- (near U37) BT_HOST_WAKE
- AP6212A: X4=26M
  AP6255: X4=37.4M
- WL_REG_ON
- WL_HOST_WAKE
- (in symbol Embest Title) Title:; Size:; Document Number:; Rev:; Draw By:; Date:; Sheet:; of

### Library data of the parts
C2 = C: CAP,4.7UF,+/-10%,X5R,10V,SMD0603; Manufacturer Part Number: GRM188R61A475KE15D; Manufacturer: Murata; Embest PN: 1004001100126; Part Type: Ceramic Capacitor
C3 C464 = C: CAP,4.7UF,+/-10%,X5R,10V,SMD0603; Manufacturer: Murata; Manufacturer Part Number: GRM188R61A475KE15D; Embest PN: 1004001100126; Part Type: Ceramic Capacitor
C68 C463 = C: CAP,15pF,+/-2%,C0G,50V,SMD0402; Manufacturer Part Number: GRM1555C1H150GA01D; Manufacturer: Murata; Embest PN: 1004001100319; Datasheet: Y:\ÐÂK3ÏµÍ³ÎïÁÏdatasheet\[1003_1004]capacitor-resistor µçÈÝ¡¢µç×è\1004001100319 GRM1555C1H150GA01DMurata.pdf; Part Type: Ceramic Capacitor
C268 = C: Cap  Ceramic 1.5pF, +-0.25pF, 50V, C0G, 0402; Manufacturer: Murata; Manufacturer Part Number: GRM1555C1H1R5CA01D; Embest PN: 1004001100401; Part Type: Ceramic Capacitor
C472 = C: CAP,100NF,+/-10%,X7R,16V,SMD0402; Manufacturer Part Number: GRM155R71C104KA88D; Manufacturer: Murata; Embest PN: 1004001100047; Datasheet: Y:\ÐÂK3ÏµÍ³ÎïÁÏdatasheet\[1003_1004]capacitor-resistor µçÈÝ¡¢µç×è\1004001100047-GRM155R71C104KA88D.pdf; Part Type: Ceramic Capacitor
C488 = C: CAP,1.0PF,+/-0.1PF,50V,SMD0402,LowESR,High-Q type; Manufacturer Part Number: GJM1555C1H1R0BB01D; Manufacturer: Murata; Embest PN: 1004001100306; Datasheet: Y:\ÐÂK3ÏµÍ³ÎïÁÏdatasheet\[1003_1004]capacitor-resistor µçÈÝ¡¢µç×è\1004001100306 GJM1555C1H1R0BB01D murata.pdf; Part Type: Ceramic Capacitor
J33 = ANT3P: Connector,Coaxial Connector,U.FL-R-SMT-1,6GHZ,SMD,TR  U.FL-R-SMT-1(10) Packing for2,500 pcs/reel or U.FL-R-SMT-1(40) Packing for4,000 pcs/reel; Manufacturer: HIROSE; Embest PN: 1009019100014; Part Type: RF CONNECTOR; Manufacturer Part Number: U.FL-R-SMT-1(10); Datasheet: Y:\ÐÂK3ÏµÍ³ÎïÁÏdatasheet\[1009]connectors Á¬½ÓÆ÷\1009019100014 U.FL-R-SMT-1(10) hirose.pdf
L30 = L: Power Inductor,Magnetic shielded,4.7uH,1.05A,0.338ohm,2.5x2.0x1.2mm,SMD; Manufacturer: TDK; Manufacturer Part Number: VLS252012ET-4R7M; Embest PN: 1005004100057; Part Type: Power Inductor; Datasheet: Y:\ÐÂK3ÏµÍ³ÎïÁÏdatasheet\[1005]beads-inductors ´ÅÖé¡¢µç¸Ð\1005004100057_VLS252012ET_TDK.pdf
OSC1 = OSC-4: Oscillator,1651-L3273-BTBQYA,32.768KHz,+/-30ppm,3.3V,2520-4 pads,SMD; Manufacturer: INTERQUIP; Rating: 30PPM; Embest PN: 1008001100120; Status: BeagleBone AI; Manufacturer Part Number: 1651-L3273-BTBQYA; Part Type: Oscillator
R294 = R: RES,100R,+/-1%,1/16W,SMD0402,ALT_CODE:15052701; Manufacturer: YAGEO; Manufacturer Part Number: RC0402FR-07100RL; Embest PN: 1003001100019; Part Type: Thick film Resistor
R333 R336 R610 = R: RES,33R,+/-5%,1/16W,SMD0402; Manufacturer Part Number: RC0402JR-0733RL; Manufacturer: YAGEO; Embest PN: 1003001100010; Part Type: Thick film Resistor
R334 R337 = R: RES,33R,+/-5%,1/16W,SMD0402; Manufacturer: YAGEO; Manufacturer Part Number: RC0402JR-0733RL; Embest PN: 1003001100010; Part Type: Thick film Resistor
R338 R413 R561-R565 = R: RES,10K,+/-1%,1/16W,SMD0402; Manufacturer: YAGEO; Manufacturer Part Number: RC0402FR-0710KL; Embest PN: 1003001100071; Part Type: Thick film Resistor
R385 R611 = R: RES,0R,+/-5%,1/16W,SMD0402; Manufacturer: YAGEO; Manufacturer Part Number: RC0402JR-070RL; Embest PN: 1003001100001; Part Type: Thick film Resistor
R560 = R: RES,10K,+/-1%,1/16W,SMD0402; Manufacturer Part Number: RC0402FR-0710KL; Manufacturer: YAGEO; Embest PN: 1003001100071; Part Type: Thick film Resistor
R576 = R: RES,0R,+/-5%,1/16W,SMD0402; Manufacturer Part Number: RC0402JR-070RL; Manufacturer: YAGEO; Embest PN: 1003001100001; Part Type: Thick film Resistor
R588 = R: RES,1K,+/-5%,1/16W,SMD0402; Manufacturer Part Number: RC0402JR-071KL; Manufacturer: YAGEO; Embest PN: 1003001100035; Part Type: Thick film Resistor
R661 = R: RES,10K,+/-5%,1/16W,SMD0402; Manufacturer: YAGEO; Manufacturer Part Number: RC0402JR-0710KL; Embest PN: 1003001100072; Part Type: Thick film Resistor
U37 = AP6255: IEEE 802.11 a/b/g/n/ac WIFI with Bluetooth 4.2 combo SDIO and UART Stamp Module,AW-CM256SM,SMD; Manufacturer: AzureWave; Embest PN: 1105002000038; Datasheet: Y:\ÐÂK3ÏµÍ³ÎïÁÏdatasheet\[1016_1101_1106~9]packing_accessories°ü²Ä_¸¨ÁÏ_Åä¼þ\1105001200006 AP6255+datasheet_V1.5_05112017.pdf; Status: BeagleBone AI; Manufacturer Part Number: AW-CM256SM; Part Type: Wi-fi Module
X4 = X4: XTAL,37.4MHz,12PF 1.6x1.2mm,,X37M400000S002, SMT TR; Manufacturer: AEL; Embest PN: 1008002100155; Datasheet: Y:\ÐÂK3ÏµÍ³ÎïÁÏdatasheet\[1008]crystal ¾§Ìå\1008002100155  X37M400000S002.pdf; Manufacturer Part Number: X37M400000S002; Part Type: Crystal
*#13 = Embest Title: Page Create Date: May 29, 2006; WebSite: http://www.embest-tech.com; Company: Embest; Page Modify Date: *

## Sheet 16 Ethernet.SchDoc
size 420 x 297 mm
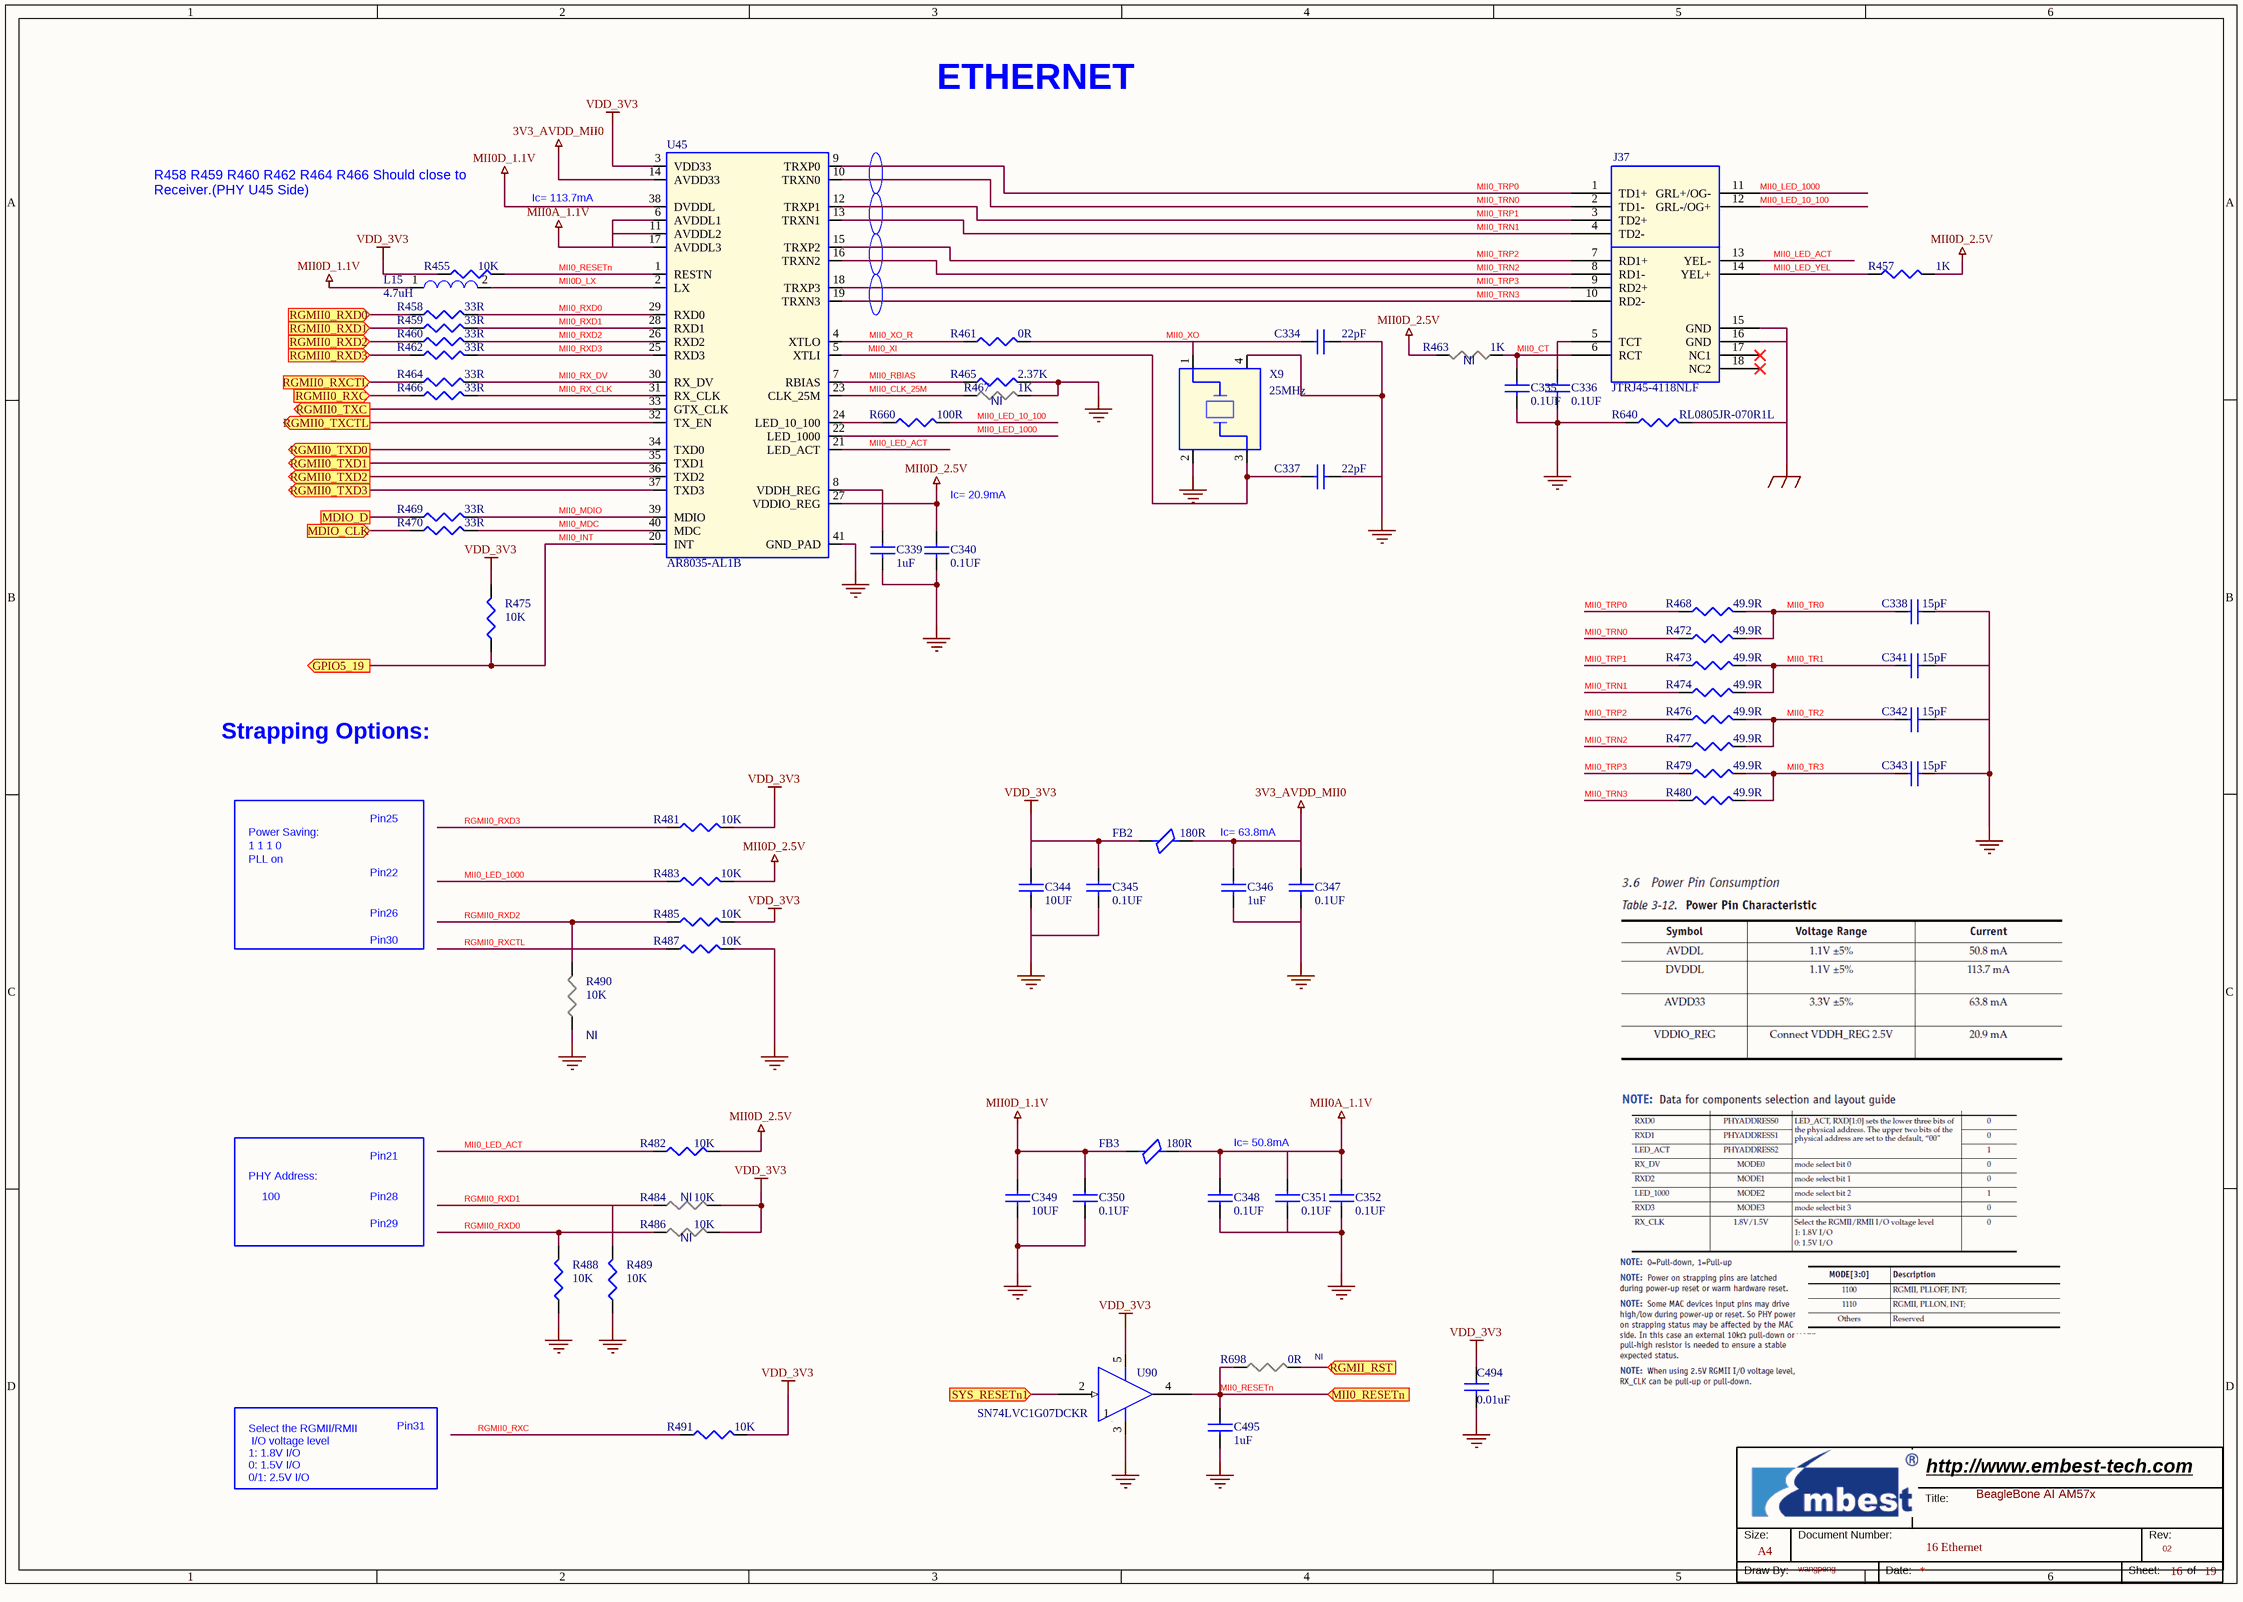
[diagram p17: 16 Ethernet.SchDoc]

### Parts
(Parts that share a designator on the sheet are numbered #1, #2 ... from top to bottom, then left to right.)
*#14  Page Count: 19  Page Number: 16  Page Size: A4  Title: BeagleBone AI AM57x  RevCode: 02  Doc: 16 Ethernet  Drawing: wangpeng  (hidden comment: Embest Title)  (graphical)
C334  22pF  [C0402]
C335  0.1UF  [C0402]
C336  0.1UF  [C0402]
C337  22pF  [C0402]
C338  15pF  [C0402]
C339  1uF  [C0402]
C340  0.1UF  [C0402]
C341  15pF  [C0402]
C342  15pF  [C0402]
C343  15pF  [C0402]
C344  10UF  [C0603]
C345  0.1UF  [C0402]
C346  1uF  [C0402]
C347  0.1UF  [C0402]
C348  0.1UF  [C0402]
C349  10UF  [C0603]
C350  0.1UF  [C0402]
C351  0.1UF  [C0402]
C352  0.1UF  [C0402]
C494  0.01uF  [C0402]
C495  1uF  [C0402]
FB2  180R  [L0603]
FB3  180R  [L0603]
J37  JTRJ45-4118NLF  [RJ45_MTCONN_JTRJ45-4118NLF]
L15  4.7uH  [L30X30_A]
R455  10K  [R0402]
R457  1K  [R0402]
R458  33R  [R0402]
R459  33R  [R0402]
R460  33R  [R0402]
R461  0R  [R0402]
R462  33R  [R0402]
R463  1K  ASSY: NI  [R0402]
R464  33R  [R0402]
R465  2.37K  [R0402]
R466  33R  [R0402]
R467  1K  ASSY: NI  [R0402]
R468  49.9R  [R0402]
R469  33R  [R0402]
R470  33R  [R0402]
R472  49.9R  [R0402]
R473  49.9R  [R0402]
R474  49.9R  [R0402]
R475  10K  [R0402]
R476  49.9R  [R0402]
R477  49.9R  [R0402]
R479  49.9R  [R0402]
R480  49.9R  [R0402]
R481  10K  [R0402]
R482  10K  [R0402]
R483  10K  [R0402]
R484  10K  ASSY: NI  [R0402]
R485  10K  [R0402]
R486  10K  ASSY: NI  [R0402]
R487  10K  [R0402]
R488  10K  [R0402]
R489  10K  [R0402]
R490  10K  ASSY: NI  [R0402]
R491  10K  [R0402]
R640  RL0805JR-070R1L  [R0805]
R660  100R  [R0402]
R698  0R  ASSY: NI  [R0402]
U45  AR8035-AL1B  [QFN40_1P4H]
U90  SN74LVC1G07DCKR  [SC70_5]
X9  25MHz  [OSCCC250x200x60-4N]

### Ports
GPIO5_19 (out), MDIO_CLK (in), MDIO_D, MII0_RESETn (in), RGMII0_RXC (in), RGMII0_RXCTL (in), RGMII0_RXD0 (in), RGMII0_RXD1 (in), RGMII0_RXD2 (in), RGMII0_RXD3 (in), RGMII0_TXC (out), RGMII0_TXCTL (out), RGMII0_TXD0 (out), RGMII0_TXD1 (out), RGMII0_TXD2 (out), RGMII0_TXD3 (out), RGMII_RST (in), SYS_RESETn1 (in)

### Nets
3V3_AVDD_MII0: C346.1 C347.1 FB2.2 U45.14(AVDD33)
GND: C334.2 C335.2 C336.2 C337.2 C338.2 C339.2 C340.2 C341.2 C342.2 C343.2 C344.2 C345.2 C346.2 C347.2 C348.2 C349.2 C350.2 C351.2 C352.2 C494.2 C495.2 R465.2 R467.2 R487.2 R488.1 R489.1 R490.1 R640.1 U45.41(GND_PAD) U90.3(GND) X9.2 X9.4  [project net DDR1_RST]
GND_EARTH: J37.15(GND) J37.16(GND) R640.2
MII0A_1.1V: C348.1 C351.1 C352.1 FB3.2 U45.6(AVDDL1) U45.11(AVDDL2) U45.17(AVDDL3)
MII0D_1.1V: C349.1 C350.1 FB3.1 L15.1 U45.38(DVDDL)
MII0D_2.5V: C340.1 R457.2 R463.2 R482.2 R483.2 U45.27(VDDIO_REG)
VDD_3V3: C344.1 C345.1 C494.1 FB2.1 R455.1 R475.2 R481.2 R484.2 R485.2 R486.2 R491.2 U45.3(VDD33) U90.5(VCC)
MCLK: R470.1 ; port MDIO_CLK
MDIO: R469.1 ; port MDIO_D
MII0_CLK_25M: R467.1 U45.23(CLK_25M)
MII0_CT: C335.1 J37.6(RCT) R463.1
MII0_INT: R475.1 U45.20(INT) ; port GPIO5_19
MII0_LED_10_100: J37.12(GRL-/OG+) R660.2
MII0_LED_1000: J37.11(GRL+/OG-) R483.1 U45.22(LED_1000)
MII0_LED_ACT: J37.13(YEL-) R482.1 U45.21(LED_ACT)
MII0_LED_YEL: J37.14(YEL+) R457.1
MII0_MDC: R470.2 U45.40(MDC)
MII0_MDIO: R469.2 U45.39(MDIO)
MII0_RBIAS: R465.1 U45.7(RBIAS)
MII0_RESETn: C495.1 R455.2 R698.1 U45.1(RESTN) U90.4(Y) ; port MII0_RESETn
MII0_RX_CLK: R466.2 U45.31(RX_CLK)
MII0_RX_DV: R464.2 U45.30(RX_DV)
MII0_RXD0: R458.2 U45.29(RXD0)
MII0_RXD1: R459.2 U45.28(RXD1)
MII0_RXD2: R460.2 U45.26(RXD2)
MII0_RXD3: R462.2 U45.25(RXD3)
MII0_TR0: C338.1 R468.2 R472.2
MII0_TR1: C341.1 R473.2 R474.2
MII0_TR2: C342.1 R476.2 R477.2
MII0_TR3: C343.1 R479.2 R480.2
MII0_TRN0: J37.2(TD1-) R472.1 U45.10(TRXN0)
MII0_TRN1: J37.4(TD2-) R474.1 U45.13(TRXN1)
MII0_TRN2: J37.8(RD1-) R477.1 U45.16(TRXN2)
MII0_TRN3: J37.10(RD2-) R480.1 U45.19(TRXN3)
MII0_TRP0: J37.1(TD1+) R468.1 U45.9(TRXP0)
MII0_TRP1: J37.3(TD2+) R473.1 U45.12(TRXP1)
MII0_TRP2: J37.7(RD1+) R476.1 U45.15(TRXP2)
MII0_TRP3: J37.9(RD2+) R479.1 U45.18(TRXP3)
MII0_XI: C337.1 U45.5(XTLI) X9.3
MII0_XO: C334.1 R461.2 X9.1
MII0_XO_R: R461.1 U45.4(XTLO)
MII0D_LX: L15.2 U45.2(LX)
RGMII0_RXC: R491.1
RGMII0_RXCTL: R487.1
RGMII0_RXD0: R486.1 R488.2
RGMII0_RXD1: R484.1 R489.2
RGMII0_RXD2: R485.1 R490.2
RGMII0_RXD3: R481.1
NetC336_1: C336.1 J37.5(TCT)
NetC339_1: C339.1 U45.8(VDDH_REG)
NetR92_2: U45.34(TXD0) ; port RGMII0_TXD0
NetR93_2: U45.35(TXD1) ; port RGMII0_TXD1
NetR94_2: U45.36(TXD2) ; port RGMII0_TXD2
NetR95_2: U45.37(TXD3) ; port RGMII0_TXD3
NetR96_2: U45.32(TX_EN) ; port RGMII0_TXCTL
NetR97_2: U45.33(GTX_CLK) ; port RGMII0_TXC
NetR458_1: R458.1 ; port RGMII0_RXD0
NetR459_1: R459.1 ; port RGMII0_RXD1
NetR460_1: R460.1 ; port RGMII0_RXD2
NetR462_1: R462.1 ; port RGMII0_RXD3
NetR464_1: R464.1 ; port RGMII0_RXCTL
NetR466_1: R466.1 ; port RGMII0_RXC
NetR660_1: R660.1 U45.24(LED_10_100)
NetR680_2: U90.2(A) ; port SYS_RESETn1
NetR698_2: R698.2 ; port RGMII_RST

Not connected (* = marked no-connect by the designer): J37 17(NC1)* 18(NC2)*; U90 1(NC)

### Notes on the sheet
- ETHERNET
- R458 R459 R460 R462 R464 R466 Should close to
  Receiver.(PHY U45 Side)
- Ic= 113.7mA
- Ic= 20.9mA
- Strapping Options:
- PLL on
- Power Saving:
- 1 1 1 0
- Pin25
- Ic= 63.8mA
- Pin26
- Pin22
- Pin30
- PHY Address:
- 100
- Pin28
- Pin21
- Ic= 50.8mA
- Pin29
- Select the RGMII/RMII
  I/O voltage level
  1: 1.8V I/O
  0: 1.5V I/O
  0/1: 2.5V I/O
- Pin31
- (in symbol Embest Title) Title:; Size:; Document Number:; Rev:; Draw By:; Date:; Sheet:; of

### Library data of the parts
C334 C337 = C: CAP,22PF,+/-5%,C0G,50V,SMD0402; Manufacturer: Murata; Manufacturer Part Number: GRM1555C1H220JA01D; Embest PN: 1004001100011; Part Type: Ceramic Capacitor
C335 C340 C347 C350 = C: CAP,100NF,+/-10%,X7R,16V,SMD0402; Manufacturer: Murata; Manufacturer Part Number: GRM155R71C104KA88D; Embest PN: 1004001100047; Part Type: Ceramic Capacitor; Datasheet: Y:\ÐÂK3ÏµÍ³ÎïÁÏdatasheet\[1003_1004]capacitor-resistor µçÈÝ¡¢µç×è\1004001100047-GRM155R71C104KA88D.pdf
C336 C345 C348 C351 C352 = C: as C472 on sheet 15 WIFI; Datasheet: Y:\ÐÂK3ÏµÍ³ÎïÁÏdatasheet\[1003_1004]capacitor-resistor µçÈÝ¡¢µç×è\1004001100047-GRM155R71C104KA88D.pdf; Part Type: Ceramic Capacitor
C338 C341-C343 = C: CAP,15pF,+/-2%,C0G,50V,SMD0402; Manufacturer: Murata; Manufacturer Part Number: GRM1555C1H150GA01D; Embest PN: 1004001100319; Part Type: Ceramic Capacitor; Datasheet: Y:\ÐÂK3ÏµÍ³ÎïÁÏdatasheet\[1003_1004]capacitor-resistor µçÈÝ¡¢µç×è\1004001100319 GRM1555C1H150GA01DMurata.pdf
C339 = C: CAP,1UF,+/-10%,X5R,10V,SMD0402; Manufacturer: Murata; Manufacturer Part Number: GRM155R61A105KE15D; Embest PN: 1004001100057; Part Type: Ceramic Capacitor
C344 = C: CAP,10UF,+/-10%,X5R,10V,SMD0603; Manufacturer: Murata; Manufacturer Part Number: GRM188R61A106KE69D; Embest PN: 1004001100129; Part Type: Ceramic Capacitor; Datasheet: Y:\ÐÂK3ÏµÍ³ÎïÁÏdatasheet\[1003_1004]capacitor-resistor µçÈÝ¡¢µç×è\1004001100129T2 C1608X5R1A106M.pdf
C346 C495 = C: CAP,1UF,+/-10%,X5R,10V,SMD0402; Manufacturer Part Number: GRM155R61A105KE15D; Manufacturer: Murata; Embest PN: 1004001100057; Part Type: Ceramic Capacitor
C349 = C: CAP,10UF,+/-10%,X5R,10V,SMD0603; Manufacturer Part Number: GRM188R61A106KE69D; Manufacturer: Murata; Embest PN: 1004001100129; Datasheet: Y:\ÐÂK3ÏµÍ³ÎïÁÏdatasheet\[1003_1004]capacitor-resistor µçÈÝ¡¢µç×è\1004001100129T2 C1608X5R1A106M.pdf; Part Type: Ceramic Capacitor
C494 = C: CAP,10NF,+/-10%,X7R,16V,SMD0402; Manufacturer: MURATA; Manufacturer Part Number: GRM155R71C103KA01D; Embest PN: 1004001100039; Part Type: Ceramic Capacitor
FB2 = FB: Ferrite Bead,180ohm@100MHz,+/-25%,1500mA,0.09ohm,SMD0603; Manufacturer: Murata; Manufacturer Part Number: BLM18PG181SN1D; Embest PN: 1005005100012; Part Type: Ferrite Bead
FB3 = FB: Ferrite Bead,180ohm@100MHz,+/-25%,1500mA,0.09ohm,SMD0603; Manufacturer Part Number: BLM18PG181SN1D; Manufacturer: Murata; Embest PN: 1005005100012; Part Type: Ferrite Bead
J37 = JTRJ45-4118NLF: Connector,RJ45 Jack with integrated magnetics and Y/G/Y Three leds,Right Angle,1000M,Gold Flash 6u,Black,21.35x15.95x13.50MM,DIP; Manufacturer: MTCONN; Embest PN: 1009023100008; Datasheet: Y:\ÐÂK3ÏµÍ³ÎïÁÏdatasheet\[1009]connectors Á¬½ÓÆ÷\1009023100008 JTRJ45-4118NLF.pdf; Status: Hamster AM572x; Manufacturer Part Number: JTRJ45-4118NLF; Part Type: Modular jack
L15 = L: Power Inductor,Magnetic shielded,4.7uH,1.2A,0.14ohm,3X3X1.8mm,SMD; Manufacturer: Sumida; Manufacturer Part Number: CDRH2D18/HPNP-4R7NC; Embest PN: 1005004100062; Part Type: Power Inductor; Datasheet: Y:\ÐÂK3ÏµÍ³ÎïÁÏdatasheet\[1005]beads-inductors ´ÅÖé¡¢µç¸Ð\1005004100062_CDRH2D18HP_SUMIDA.pdf
R455 R475 R483 R484 R486 R488 R490 = R: as R338 on sheet 15 WIFI; Part Type: Thick film Resistor
R457 R463 = R: RES,1K,+/-1%,1/16W,SMD0402; Manufacturer: YAGEO; Manufacturer Part Number: RC0402FR-071KL; Embest PN: 1003001100034; Part Type: Thick film Resistor
R458-R460 R462 R464 = R: as R334 on sheet 15 WIFI; Part Type: Thick film Resistor
R461 = R: as R576 on sheet 15 WIFI; Part Type: Thick film Resistor
R465 = R: RES,2K37,+/-1%,1/16W,SMD0402; Manufacturer: YAGEO; Manufacturer Part Number: RC0402FR-072K37L; Embest PN: 1003001100047; Part Type: Thick film Resistor
R466 R469 R470 = R: as R333 on sheet 15 WIFI; Part Type: Thick film Resistor
R467 = R: RES,1K,+/-1%,1/16W,SMD0402; Manufacturer Part Number: RC0402FR-071KL; Manufacturer: YAGEO; Embest PN: 1003001100034; Part Type: Thick film Resistor
R468 R472-R474 R476 R477 R479 R480 = R: RES,49R9,+/-1%,1/16W,SMD0402; Manufacturer Part Number: RC0402FR-0749R9L; Manufacturer: YAGEO; Embest PN: 1003001100015; Part Type: Thick film Resistor; VPN: RC0402FR-0749R9L
R481 R482 R485 R487 R489 R491 = R: as R560 on sheet 15 WIFI; Part Type: Thick film Resistor
R640 = R: RES,0R1,+/-5%,1/8W,SMD0805; Manufacturer: Yageo; Rating: <Rating>; Embest PN: 1003001100451; Status: TBD; Manufacturer Part Number: RL0805JR-070R1L; Part Type: Thick film Resistor
R660 = R: RES,100R,+/-5%,1/16W,SMD0402; Manufacturer Part Number: RC0402JR-07100RL; Manufacturer: YAGEO; Embest PN: 1003001100020; Part Type: Thick film Resistor
R698 = R: as R385 on sheet 15 WIFI; Part Type: Thick film Resistor
U45 = AR8035: IC,Ultra low-power single RGMII Gigabit Ethernet PHY,AR8035,QFN-40,SMD; Manufacturer: ATHEROS; Embest PN: 1002016100028; Part Type: Ethernet; Manufacturer Part Number: AR8035-AL1B; Datasheet: Y:\ÐÂK3ÏµÍ³ÎïÁÏdatasheet\[1002]IC ¼¯³ÉµçÂ·\1002016100028 AR8035-AL1B.pdf
U90 = SN74LVC1G07DCKR: IC,SINGLE BUFFER/DRIVER WITH OPEN-DRAIN OUTPUT,SN74LVC1G07DCKR,SC-70,SMD; Manufacturer: TI; Embest PN: 1002008100087; Part Type: Logic; Manufacturer Part Number: SN74LVC1G07DCKR; Datasheet: Y:\ÐÂK3ÏµÍ³ÎïÁÏdatasheet\[1002]IC ¼¯³ÉµçÂ·\1002008100087 sn74lvc1g07 ti.pdf
X9 = X4: Crystal,5ZAA25000202TFA0Q3,25MHz,+/-20PPM,20PF,2520-4 pads,SMD; Manufacturer: INTERQUIP; Embest PN: 1008002100255; Rating: 20PPM; Part Type: Crystal; Manufacturer Part Number: 5ZAA25000202TFA0Q3; Status: Hamster AM572x; Datasheet: Y:\ÐÂK3ÏµÍ³ÎïÁÏdatasheet\[1008]crystal ¾§Ìå\1008002100255 5ZAA25000202TFA0Q3¹æ¸ñÊé.pdf
*#14 = Embest Title: Page Create Date: May 29, 2006; WebSite: http://www.embest-tech.com; Company: Embest; Page Modify Date: *

## Sheet 17 USB Type C.SchDoc
size 420 x 297 mm
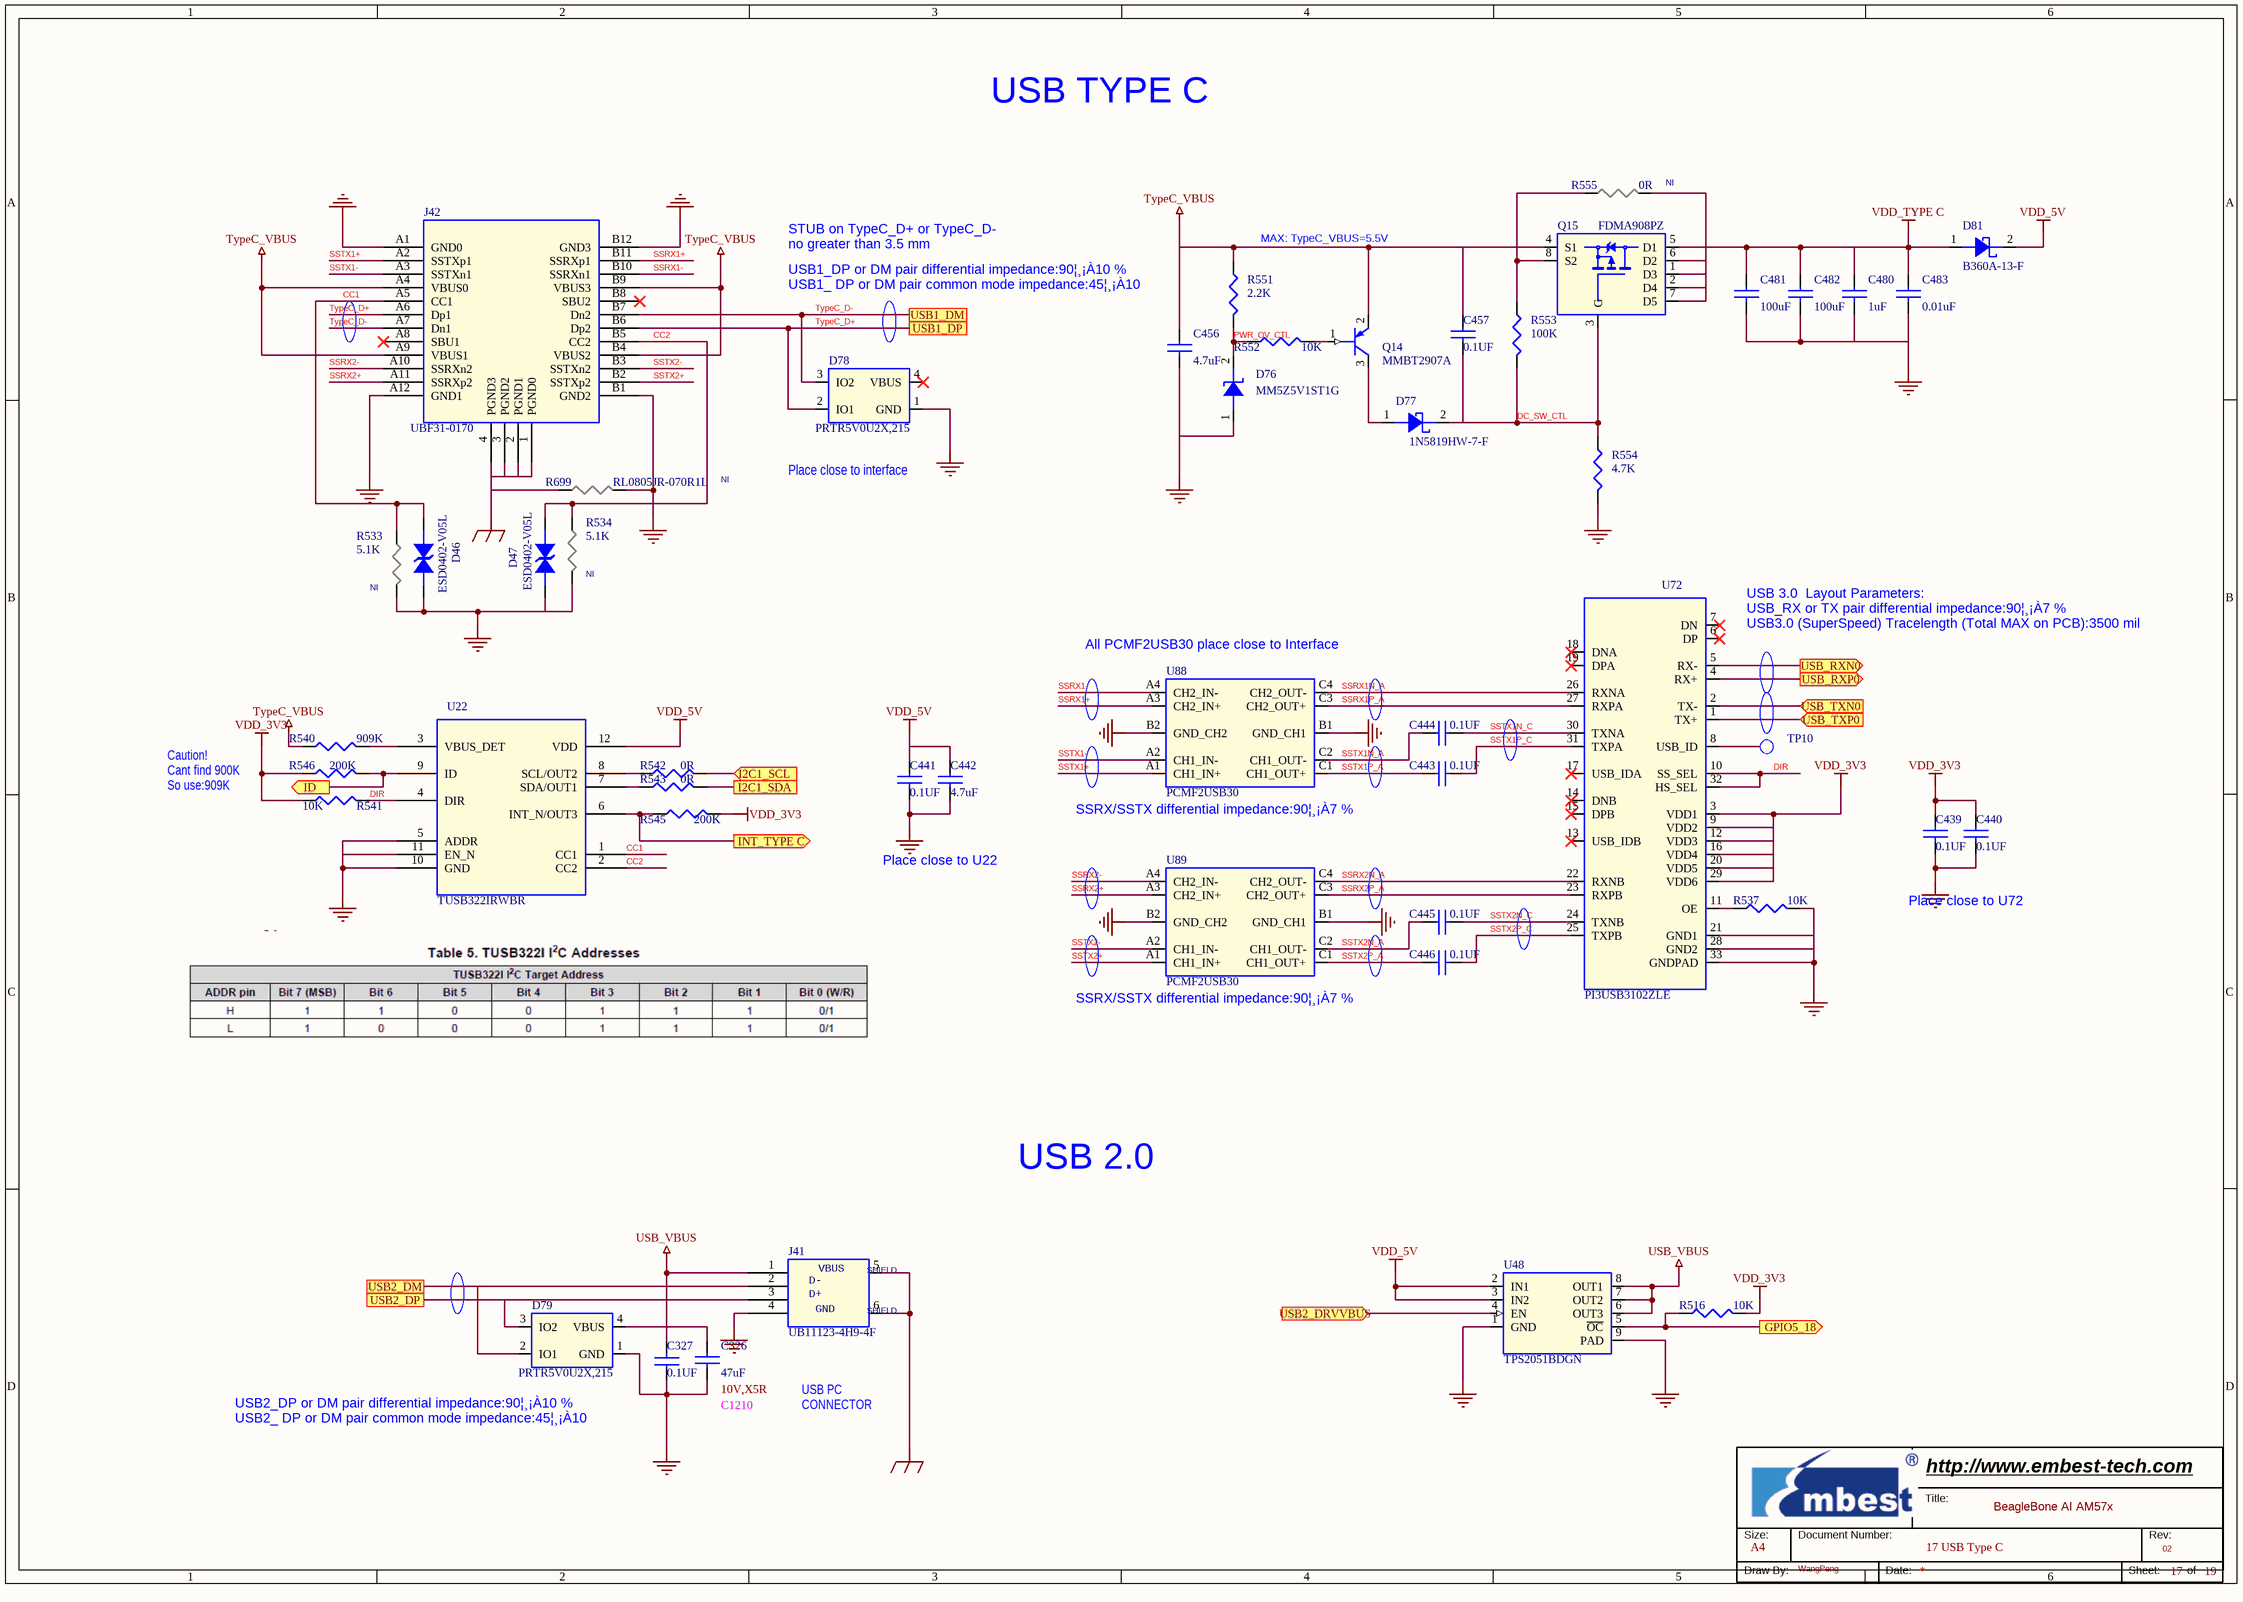
[diagram p18: 17 USB Type C.SchDoc]

### Parts
(Parts that share a designator on the sheet are numbered #1, #2 ... from top to bottom, then left to right.)
*#15  Page Count: 19  Page Number: 17  Page Size: A4  Title: BeagleBone AI AM57x  RevCode: 02  Doc: 17 USB Type C  Drawing: WangPeng  (hidden comment: Embest Title)  (graphical)
C326  47uF  Rating: 10V,X5R  [C1210]
C327  0.1UF  [C0402]
C439  0.1UF  [C0402]
C440  0.1UF  [C0402]
C441  0.1UF  [C0402]
C442  4.7uF  [C0603]
C443  0.1UF  [C0402]
C444  0.1UF  [C0402]
C445  0.1UF  [C0402]
C446  0.1UF  [C0402]
C456  4.7uF  [C0603]
C457  0.1UF  [C0402]
C480  1uF  [C0402]
C481  100uF  [C1210]
C482  100uF  [C1210]
C483  0.01uF  [C0402]
D46  ESD0402-V05L  [D0402]
D47  ESD0402-V05L  [D0402]
D76  MM5Z5V1ST1G  [sod523]
D77  1N5819HW-7-F  [sod123_a]
D78  PRTR5V0U2X,215  [SOT143_190P240X115-4N]
D79  PRTR5V0U2X,215  [SOT143_190P240X115-4N]
D81  B360A-13-F  [D_SMA]
J41  UB11123-4H9-4F  [usb_a_sh]
J42  UBF31-0170  [USB_MTCONN_UBF31-0170]
Q14  MMBT2907A  [SOT23_123]
Q15  FDMA908PZ  [DFN6_2FN]
R516  10K  [R0402]
R533  5.1K  ASSY: NI  [R0402]
R534  5.1K  ASSY: NI  [R0402]
R537  10K  [R0402]
R540  909K  [R0402]
R541  10K  [R0402]
R542  0R  [R0402]
R543  0R  [R0402]
R545  200K  [R0402]
R546  200K  [R0402]
R551  2.2K  [R0402]
R552  10K  [R0402]
R553  100K  [R0402]
R554  4.7K  [R0402]
R555  0R  ASSY: NI  [R0805]
R699  RL0805JR-070R1L  ASSY: NI  [R0805]
TP10  NI  [TP1-8040]  (value not drawn)
U22  TUSB322IRWBR  [X2QFN40P160X160X40-12N]
U48  TPS2051BDGN  [SOP8_1FH]
U72  PI3USB3102ZLE  [QFN40P300x600x80-33N]
U88  PCMF2USB30  [WLCSP10C40p3x4_117x157x60N]
U89  PCMF2USB30  [WLCSP10C40p3x4_117x157x60N]

### Ports
GPIO5_18 (out), I2C1_SCL (in), I2C1_SDA, ID (out), INT_TYPE C (out), USB1_DM, USB1_DP, USB2_DM, USB2_DP, USB2_DRVVBUS (in), USB_RXN0 (out), USB_RXP0 (out), USB_TXN0 (in), USB_TXP0 (in)

### Nets
GND: C326.2 C327.1 C439.2 C440.2 C441.2 C442.2 C456.2 C480.2 C481.2 C482.2 C483.2 D46.1 D47.1 D76.1(A) D78.1(GND) D79.1(GND) J41.4(P4) J42.A1(GND0) J42.A12(GND1) J42.B1(GND2) J42.B12(GND3) R533.2 R534.2 R537.2 R554.2 R699.2 U22.5(ADDR) U22.10(GND) U22.11(EN_N) U48.1(GND) U48.9(PAD) U72.21(GND1) U72.28(GND2) U72.33(GNDPAD) U88.B1(GND_CH1) U88.B2(GND_CH2) U89.B1(GND_CH1) U89.B2(GND_CH2)  [project net DDR1_RST]
GND_EARTH: J41.5(SHELD1) J41.6(PAD4) J42.1(PGND0) J42.2(PGND1) J42.3(PGND2) J42.4(PGND3) R699.1
TypeC_VBUS: C456.1 C457.1 J42.A4(VBUS0) J42.A9(VBUS1) J42.B4(VBUS2) J42.B9(VBUS3) Q14.2(E) Q15.4(S1) R540.1 R551.1
USB_VBUS: C327.2 J41.1(P1) U48.6(OUT3) U48.7(OUT2) U48.8(OUT1)
VDD_3V3: C439.1 C440.1 R516.2 R541.2 R545.2 R546.1 U72.3(VDD1) U72.9(VDD2) U72.12(VDD3) U72.16(VDD4) U72.20(VDD5) U72.29(VDD6)
VDD_5V: C441.1 C442.1 D81.2(C) U22.12(VDD) U48.2(IN1) U48.3(IN2)
VDD_TYPE C: C480.1 C481.1 C482.1 C483.1 D81.1(A) Q15.5(D1)
CC1: D46.2 J42.A5(CC1) R533.1 U22.1(CC1)
CC2: D47.2 J42.B5(CC2) R534.1 U22.2(CC2)
DC_SW_CTL: C457.2 D77.2(C) Q15.3(G) R553.2 R554.1
DIR: R541.1 U22.4(DIR) U72.10(SS_SEL) U72.32(HS_SEL)
I2C1_SCL: R542.2 ; port I2C1_SCL
I2C1_SDA: R543.2 ; port I2C1_SDA
PWR_OV_CTL: D76.2(C) R551.2 R552.1
SSRX1+: J42.B11(SSRXp1) U88.A3(CH2_IN+)
SSRX1-: J42.B10(SSRXn1) U88.A4(CH2_IN-)
SSRX1N_A: U72.26(RXNA) U88.C4(CH2_OUT-)
SSRX1P_A: U72.27(RXPA) U88.C3(CH2_OUT+)
SSRX2+: J42.A11(SSRXp2) U89.A3(CH2_IN+)
SSRX2-: J42.A10(SSRXn2) U89.A4(CH2_IN-)
SSRX2N_A: U72.22(RXNB) U89.C4(CH2_OUT-)
SSRX2P_A: U72.23(RXPB) U89.C3(CH2_OUT+)
SSTX1+: J42.A2(SSTXp1) U88.A1(CH1_IN+)
SSTX1-: J42.A3(SSTXn1) U88.A2(CH1_IN-)
SSTX1N_A: C444.1 U88.C2(CH1_OUT-)
SSTX1N_C: C444.2 U72.30(TXNA)
SSTX1P_A: C443.1 U88.C1(CH1_OUT+)
SSTX1P_C: C443.2 U72.31(TXPA)
SSTX2+: J42.B2(SSTXp2) U89.A1(CH1_IN+)
SSTX2-: J42.B3(SSTXn2) U89.A2(CH1_IN-)
SSTX2N_A: C445.1 U89.C2(CH1_OUT-)
SSTX2N_C: C445.2 U72.24(TXNB)
SSTX2P_A: C446.1 U89.C1(CH1_OUT+)
SSTX2P_C: C446.2 U72.25(TXPB)
TypeC_D+: D78.2(IO1) J42.A6(Dp1) J42.B6(Dp2) ; port USB1_DP
TypeC_D-: D78.3(IO2) J42.A7(Dn1) J42.B7(Dn2) ; port USB1_DM
NetC326_1: C326.1 D79.4(VBUS)
NetD77_1: D77.1(A) Q14.3(C)
NetD79_2: D79.2(IO1) J41.2(P2) ; port USB2_DM
NetD79_3: D79.3(IO2) J41.3(P3) ; port USB2_DP
NetQ14_1: Q14.1(B) R552.2
NetQ15_1: Q15.1(D3) Q15.2(D4) Q15.6(D2) Q15.7(D5) R555.2
NetQ15_8: Q15.8(S2) R553.1 R555.1
NetR112_1: U48.4(EN) ; port USB2_DRVVBUS
NetR516_1: R516.1 U48.5(~{OC}) ; port GPIO5_18
NetR537_1: R537.1 U72.11(OE)
NetR540_2: R540.2 U22.3(VBUS_DET)
NetR542_1: R542.1 U22.8(SCL/OUT2)
NetR543_1: R543.1 U22.7(SDA/OUT1)
NetR545_1: R545.1 U22.6(INT_N/OUT3) ; port INT_TYPE C
NetR546_2: R546.2 U22.9(ID) ; port ID
NetTP10_1: TP10.1(TP) U72.8(USB_ID)
NetU4_AC11: U72.2(TX-) ; port USB_TXN0
NetU4_AD11: U72.1(TX+) ; port USB_TXP0
NetU4_AE12: U72.4(RX+) ; port USB_RXP0
NetU4_AF12: U72.5(RX-) ; port USB_RXN0

Not connected (* = marked no-connect by the designer): D78 4(VBUS)*; J42 A8(SBU1)* B8(SBU2)*; U72 6(DP)* 7(DN)* 13(USB_IDB)* 14(DNB)* 15(DPB)* 17(USB_IDA)* 18(DNA)* 19(DPA)*

### Notes on the sheet
- USB TYPE C
- STUB on TypeC_D+ or TypeC_D-
  no greater than 3.5 mm
- USB1_DP or DM pair differential impedance:90¦¸¡À10 %
  USB1_ DP or DM pair common mode impedance:45¦¸¡À10
- (near R551) MAX: TypeC_VBUS=5.5V
- Place close to interface
- (near U72) USB 3.0  Layout Parameters:
  USB_RX or TX pair differential impedance:90¦¸¡À7 %
  USB3.0 (SuperSpeed) Tracelength (Total MAX on PCB):3500 mil
- (near U88) All PCMF2USB30 place close to Interface
- Caution!
  Cant find 900K
  So use:909K
- (near U88) SSRX/SSTX differential impedance:90¦¸¡À7 %
- Place close to U22
- Place close to U72
- (near U89) SSRX/SSTX differential impedance:90¦¸¡À7 %
- USB 2.0
- (near D79) USB2_DP or DM pair differential impedance:90¦¸¡À10 %
  USB2_ DP or DM pair common mode impedance:45¦¸¡À10
- USB PC
  CONNECTOR
- (in symbol Embest Title) Title:; Size:; Document Number:; Rev:; Draw By:; Date:; Sheet:; of
- (in symbol USB4A_2) VBUS; SHIELD; D-; D+; GND

### Library data of the parts
C326 = C: CAP,47UF,+/-20%,X5R,10V,SMD1210; Manufacturer: MURATA; Manufacturer Part Number: GRM32ER61A476ME20; Embest PN: 1004001100185; PCB Footprint: C1210; Part Type: Ceramic Capacitor
C327 C439-C441 C457 = C: as C472 on sheet 15 WIFI; Datasheet: Y:\ÐÂK3ÏµÍ³ÎïÁÏdatasheet\[1003_1004]capacitor-resistor µçÈÝ¡¢µç×è\1004001100047-GRM155R71C104KA88D.pdf; Part Type: Ceramic Capacitor
  C439-C441: Size: 1005
C442 = C: CAP,4.7UF,+/-10%,X5R,16V,SMD0603; Manufacturer: Murata; Manufacturer Part Number: GRM188R61C475KAAJD; Embest PN: 1004001100127; Size: 1608; Part Type: Ceramic Capacitor; Datasheet: Y:\ÐÂK3ÏµÍ³ÎïÁÏdatasheet\[1003_1004]capacitor-resistor µçÈÝ¡¢µç×è\1004001100127 GRM188R61C475KAAJD murata.pdf
C443-C446 = C: as C335 on sheet 16 Ethernet; Size: 1005; Part Type: Ceramic Capacitor; Datasheet: Y:\ÐÂK3ÏµÍ³ÎïÁÏdatasheet\[1003_1004]capacitor-resistor µçÈÝ¡¢µç×è\1004001100047-GRM155R71C104KA88D.pdf
C456 = C: CAP,4.7UF,+/-10%,X5R,16V,SMD0603; Manufacturer Part Number: GRM188R61C475KAAJD; Manufacturer: Murata; Embest PN: 1004001100127; Datasheet: Y:\ÐÂK3ÏµÍ³ÎïÁÏdatasheet\[1003_1004]capacitor-resistor µçÈÝ¡¢µç×è\1004001100127 GRM188R61C475KAAJD murata.pdf; Part Type: Ceramic Capacitor
C480 = C: as C346 on sheet 16 Ethernet; Part Type: Ceramic Capacitor
C481 C482 = C: CAP,100UF,+/-20%,X5R,6.3V,SMD1210; Manufacturer Part Number: GRM32ER60J107ME20#; Manufacturer: MURATA; Embest PN: 1004001100198; Part Type: Ceramic Capacitor
C483 = C: CAP,10NF,+/-10%,X7R,16V,SMD0402; Manufacturer Part Number: GRM155R71C103KA01D; Manufacturer: MURATA; Embest PN: 1004001100039; Part Type: Ceramic Capacitor
D46 D47 = Diode TVS Dual: Diode,TVS,ESD0402-V05L, 5V, 0.1pF,0402,SMD; Manufacturer: TOPS; Embest PN: 1006005100089; Part Type: ESD; Manufacturer Part Number: ESD0402-V05L; Datasheet: Y:\ÐÂK3ÏµÍ³ÎïÁÏdatasheet\[1006002~013]diodes-transistors ¶þÈý¼«¹Ü\1006005100089 ESD0402-V5L.pdf
D76 = Diode Zener: Diode,Zener Diode,MM5Z5V1ST1G,5.1V,+/-2%,200 mW,SOD523,SMD,-65~155,AEC-Q101,TR; Manufacturer: ON; Embest PN: 1006004100023; Datasheet: Y:\ÐÂK3ÏµÍ³ÎïÁÏdatasheet\[1006002~013]diodes-transistors ¶þÈý¼«¹Ü\1006004100023_MM5Z5V1ST1G_ON.PDF; Manufacturer Part Number: MM5Z5V1ST1G; Part Type: Diode
D77 = Diode Schottky: Diode,Schottky Diode,1N5819HW-7-F,40V,1A,SOD-123,SMD,-65~125,TR; Manufacturer: DIODES; Embest PN: 1006002100003; Datasheet: Y:\ÐÂK3ÏµÍ³ÎïÁÏdatasheet\[1006002~013]diodes-transistors ¶þÈý¼«¹Ü\1006002100003_1N5819HW_DIODES.pdf; Manufacturer Part Number: 1N5819HW-7-F; Part Type: Diode
D78 D79 = WE05R: Diode,TVS,PRTR5V0U2X, 5.5V,SOT-143B,SMD; Manufacturer: NXP; Embest PN: 1006005100016; Part Type: ESD; Manufacturer Part Number: PRTR5V0U2X,215; Status: Hamster AM572x
D81 = Diode Schottky: Diode,Schottky Diode,B360A-13-F,60V,3A,SMA,SMD; Manufacturer: DIODES; Embest PN: 1006002100006; Part Type: Diode; Manufacturer Part Number: B360A-13-F; Datasheet: Y:\ÐÂK3ÏµÍ³ÎïÁÏdatasheet\[1006002~013]diodes-transistors ¶þÈý¼«¹Ü\1006002100006 B360A-13-F diodes.pdf
J41 = USB4A_2: Connector,USB A port,4 Position,female,Right Angle,30u GXT Contact,black,DIP; Manufacturer: Foxcon; Embest PN: 1009007200069; Part Type: USB Connector; Manufacturer Part Number: UB11123-4H9-4F; Status: TBD; Datasheet: Y:\ÐÂK3ÏµÍ³ÎïÁÏdatasheet\[1009]connectors Á¬½ÓÆ÷\1009007200069 [UB11123-4H9-4F].pdf
J42 = USCF-001C2BC01-11: Connector,USB type C port,female,flat insert,SMT/THT;; Manufacturer: MTCONN; Embest PN: 1009007100107; Datasheet: Y:\ÐÂK3ÏµÍ³ÎïÁÏdatasheet\[1009]connectors Á¬½ÓÆ÷\1009007100107 UBF31-0170; Status: BeagleBone AI; Manufacturer Part Number: UBF31-0170; Part Type: USB Connector
Q14 = PNP: Transistor,PNP,MMBT2907A-7-F,60V,600MA,SOT-23,SMD; Manufacturer: Diodes; Embest PN: 1006012100001; Part Type: Transistor; Manufacturer Part Number: MMBT2907A-7-F; Datasheet: Y:\ÐÂK3ÏµÍ³ÎïÁÏdatasheet\[1006002~013]diodes-transistors ¶þÈý¼«¹Ü\1006012100001 Diodes MMBT2907A-7-F.pdf
Q15 = PMOS_2S1G5D: MOSFET,Single P-Channel PowerTrench MOSFET,-12A, -12V,12.5 mohm,microFET2x2(8Pin),SMD; Manufacturer: FAIRCHILD; Embest PN: 1006014100031; Part Type: MOSFET; Manufacturer Part Number: FDMA908PZ; Datasheet: Y:\ÐÂK3ÏµÍ³ÎïÁÏdatasheet\[1006014~16]mosfet ³¡Ð§Ó¦¹Ü\1006014100031_FDMA908PZ_fairchild.pdf
R516 R537 = R: as R560 on sheet 15 WIFI; Part Type: Thick film Resistor
R533 = R: RES,5K1,+/-1%,1/16W,SMD0402; Manufacturer: YAGEO; Manufacturer Part Number: RC0402FR-075K1L; Embest PN: 1003001100059; Part Type: Thick film Resistor
R534 = R: RES,5K1,+/-1%,1/16W,SMD0402; Manufacturer Part Number: RC0402FR-075K1L; Manufacturer: YAGEO; Embest PN: 1003001100059; Part Type: Thick film Resistor
R540 = R: RES,909K,+/-1%,1/16W,SMD0402; Manufacturer: YAGEO; Manufacturer Part Number: RC0402FR-07909KL; Embest PN: 1003001101493; Part Type: Thick film Resistor; Status: BeagleBone AI
R541 = R: RES,10K,+/-5%,1/16W,SMD0402; Manufacturer Part Number: RC0402JR-0710KL; Manufacturer: YAGEO; Embest PN: 1003001100072; Part Type: Thick film Resistor
R542 R543 = R: as R385 on sheet 15 WIFI; Part Type: Thick film Resistor
R545 R546 = R: RES,200K,+/-5%,1/16W,SMD0402; Manufacturer Part Number: RC0402JR-07200KL; Manufacturer: YAGEO; Embest PN: 1003001100130; Part Type: Thick film Resistor
R551 = R: RES,2K2,+/-5%,1/16W,SMD0402; Manufacturer: YAGEO; Manufacturer Part Number: RC0402JR-072K2L; Embest PN: 1003001100046; Part Type: Thick film Resistor
R552 = R: as R661 on sheet 15 WIFI; Part Type: Thick film Resistor
R553 = R: RES,100K,+/-5%,1/16W,SMD0402; Manufacturer Part Number: RC0402JR-07100KL; Manufacturer: YAGEO; Embest PN: 1003001100119; Part Type: Thick film Resistor
R554 = R: RES,4K7,+/-5%,1/16W,SMD0402; Manufacturer Part Number: RC0402JR-074K7L; Manufacturer: YAGEO; Embest PN: 1003001100057; Part Type: Thick film Resistor
R555 = R: RES,0R,+/-5%,1/2W,SMD0805; Manufacturer: YAGEO; Manufacturer Part Number: RC0805JR-070RL; Embest PN: 1003001100295; Part Type: Thick film Resistor
R699 = R: as R640 on sheet 16 Ethernet; Status: TBD; Manufacturer Part Number: RL0805JR-070R1L; Part Type: Thick film Resistor
TP10 = TEST POINT: Test point,DIA 30mil; Embest PN: PN008; PCB Footprint: TP30; Part Type: TP
U22 = TUSB322IRWBR: USB Type C Configuration Channel Logic and Port Control with VCONN; Manufacturer: TI; Embest PN: 1002010100214; PCB Footprint: X2QFN40P160X160X40-12N; Datasheet: Y:\ÐÂK3ÏµÍ³ÎïÁÏdatasheet\[1002]IC ¼¯³ÉµçÂ·\1002010100214 tusb322i.pdf; Status: Hamster AM572x; Manufacturer Part Number: TUSB322IRWBR; Part Type: IC
U48 = TPS2051BDGN: IC,Current-Limited Power-distribution Switches,TPS2051BDGN,8-MSOP-PowerPad,SMD; Manufacturer: TI; Embest PN: 1002004100054; Datasheet: Y:\ÐÂK3ÏµÍ³ÎïÁÏdatasheet\[1002]IC ¼¯³ÉµçÂ·\1002004100054_tps2051b_TI.pdf; Status: AVL; Manufacturer Part Number: TPS2051BDGN; Part Type: Power Switch
U72 = PI3USB3102ZLE: IC USB3.0&USB2.0 SWITCH 32TQFN; Manufacturer: Pericom; Embest PN: 1002010100194; Datasheet: Y:\ÐÂK3ÏµÍ³ÎïÁÏdatasheet\[1002]IC ¼¯³ÉµçÂ·\1002010100194 PI3USB3102.pdf; Status: BBB_AM572X; Manufacturer Part Number: PI3USB3102ZLE; Part Type: Interface
U88 U89 = PCMF2USB30: Common-mode EMI filter for differential channels with integrated ESD protection /; Manufacturer: Nexperia; Embest PN: 1013002100028; PCB Footprint: WLCSP10C40p3x4_117x157x60N; Part Type: Common Mode Inductor; Manufacturer Part Number: PCMF2USB30; Status: Hamster AM572x; Datasheet: Y:\ÐÂK3ÏµÍ³ÎïÁÏdatasheet\[1013_1014]transformer-filter ±äÑ¹Æ÷¡¢ÂË²¨\1013002100028 PCMFXUSB30_SER.pdf
*#15 = Embest Title: Page Create Date: May 29, 2006; WebSite: http://www.embest-tech.com; Company: Embest; Page Modify Date: *